# EAGLE design clogic (EAGLE 6.2)

## Sheet 1 of 2
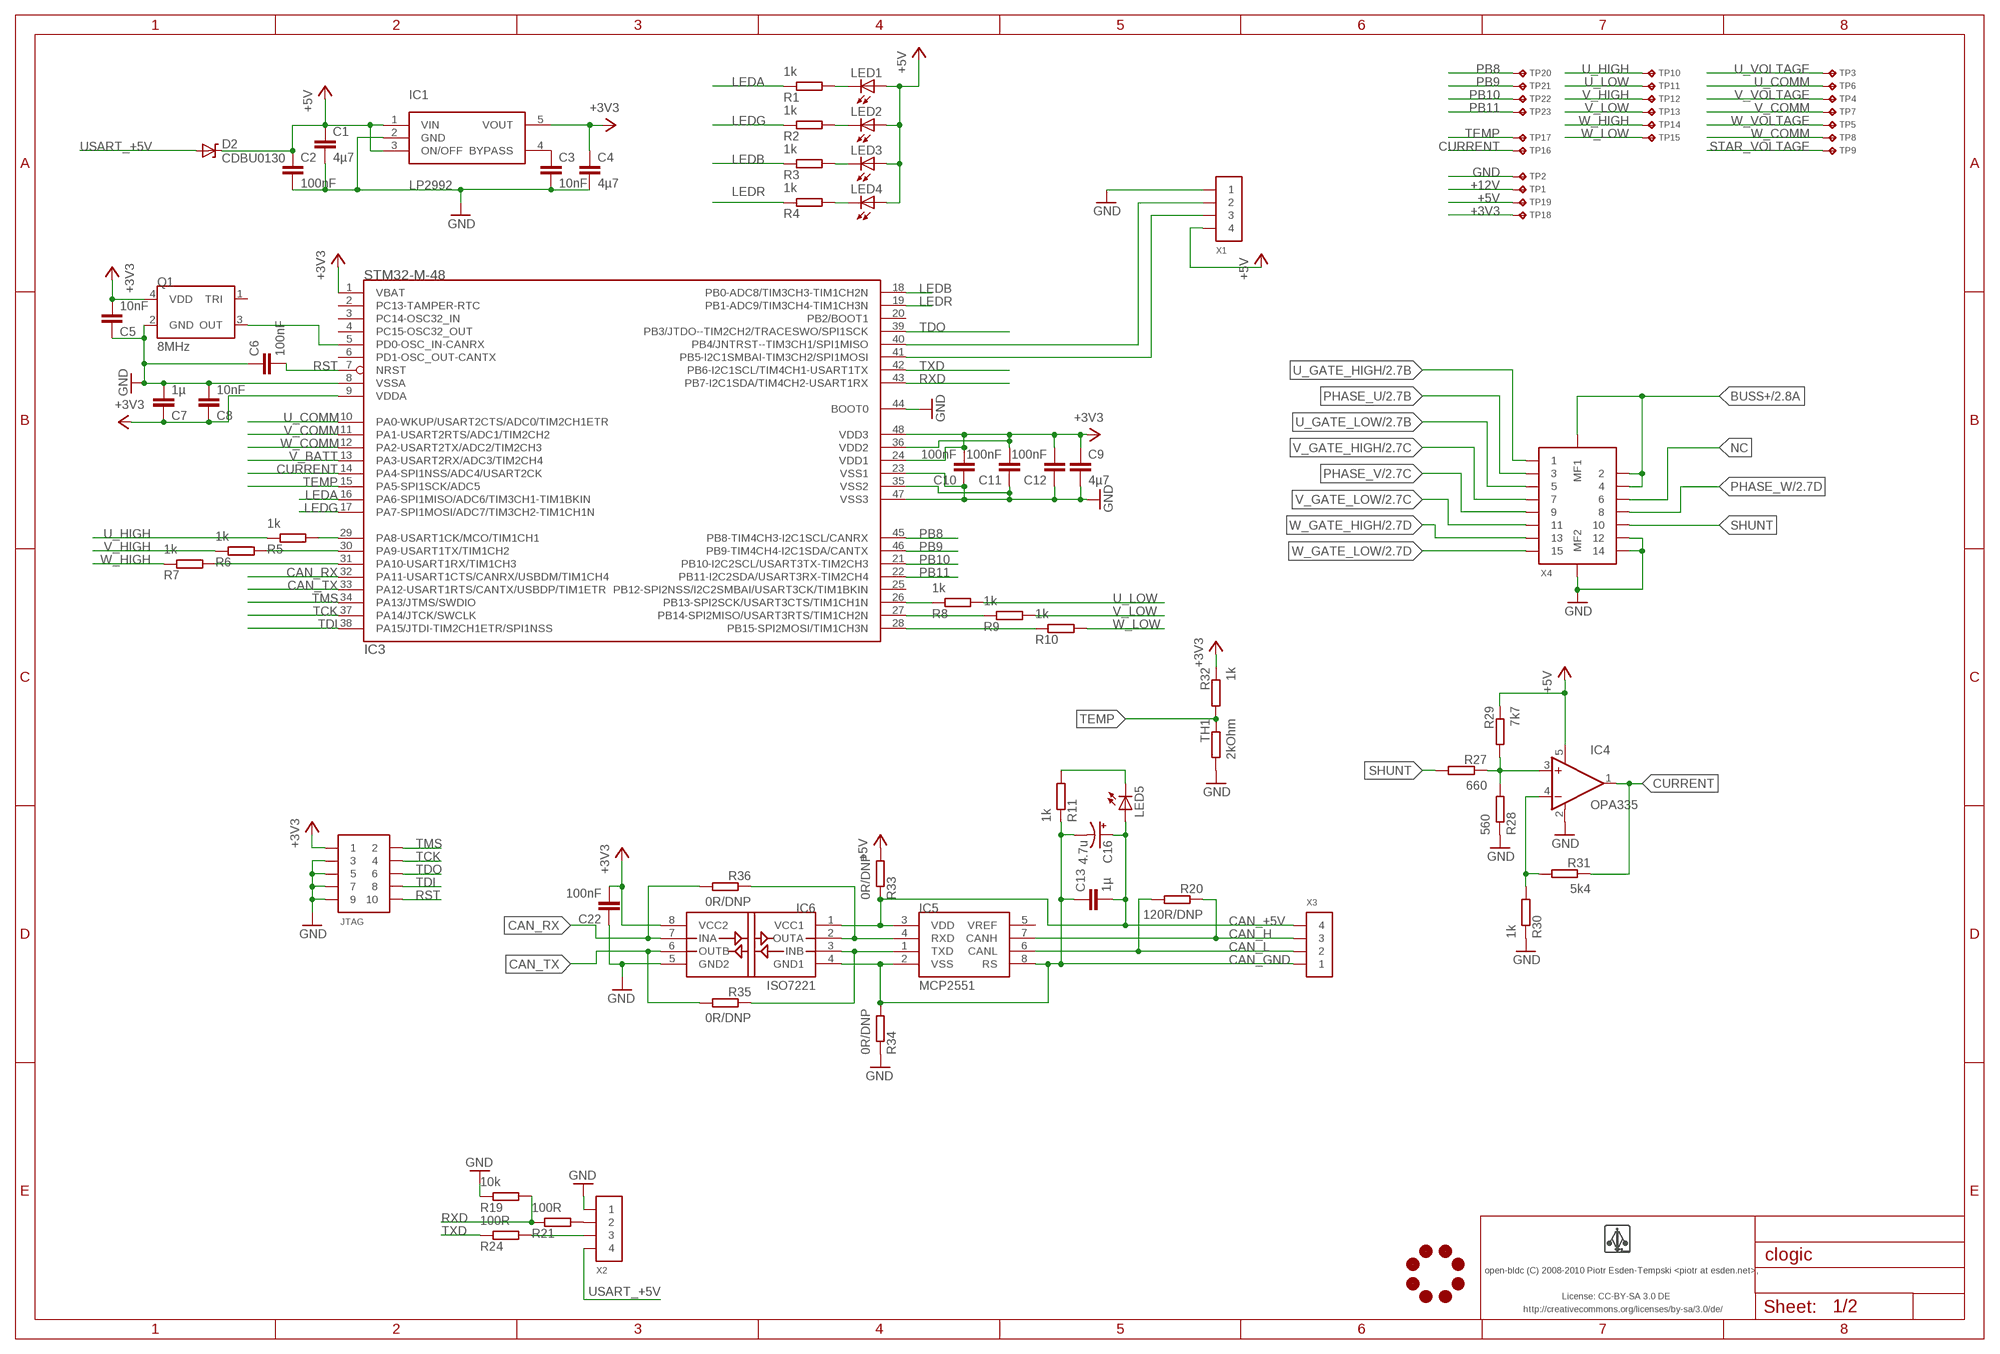
[diagram p0: schematic, sheet 1]

### Parts
C1  4µ7  CAPACITOR-0603  [0603-CAP]
C2  100nF  CAPACITOR-0603  [0603-CAP]
C3  10nF  CAPACITOR-0603  [0603-CAP]
C4  4µ7  CAPACITOR-0603  [0603-CAP]
C5  10nF  CAPACITOR-0603  [0603-CAP]
C6  100nF  CAPACITOR-0603  [0603-CAP]
C7  1µ  CAPACITOR-0603  [0603-CAP]
C8  10nF  CAPACITOR-0603  [0603-CAP]
C9  4µ7  CAPACITOR-0603  [0603-CAP]
C10  100nF  CAPACITOR-0603  [0603-CAP]
C11  100nF  CAPACITOR-0603  [0603-CAP]
C12  100nF  CAPACITOR-0603  [0603-CAP]
C13  1µ  CAPACITOR-0603  [0603-CAP]
C16  4.7u  CPOL-US  [CAP_0805TANT_F95]
C22  100nF  CAPACITOR-0603  [0603-CAP]
D2  CDBU0130  DIODE-ZENER-0603  [0603-LED]
IC1  LP2992  [SOT23-5]
IC3  STM32-M-48  [LQFP48]
IC4  OPA335  [SOT23-5]
IC5  MCP2551  [SO8]
IC6  ISO7221  [SO8]
JL1  JOBY_LOGO-6MIL  [JOBY_LOGO_6MIL]
JTAG  CONN_5-2-FTSH-V  [FTSH-105-DV]
LED1  AMBER  LED-0603  [0603-LED]
LED2  GREEN  LED-0603  [0603-LED]
LED3  BLUE  LED-0603  [0603-LED]
LED4  RED  LED-0603  [0603-LED]
LED5  WHITE  LED-0603  [0603-LED]
Q1  8MHz  ASE_ASCILLATOR  [ASE_OSCILLATOR]
R1  1k  RESISTOR-0603  [0603-RES]
R2  1k  RESISTOR-0603  [0603-RES]
R3  1k  RESISTOR-0603  [0603-RES]
R4  1k  RESISTOR-0603  [0603-RES]
R5  1k  RESISTOR-0603  [0603-RES]
R6  1k  RESISTOR-0603  [0603-RES]
R7  1k  RESISTOR-0603  [0603-RES]
R8  1k  RESISTOR-0603  [0603-RES]
R9  1k  RESISTOR-0603  [0603-RES]
R10  1k  RESISTOR-0603  [0603-RES]
R11  1k  RESISTOR-0603  [0603-RES]
R19  10k  RESISTOR-0603  [0603-RES]
R20  120R/DNP  RESISTOR-0603  [0603-RES]
R21  100R  RESISTOR-0603  [0603-RES]
R24  100R  RESISTOR-0603  [0603-RES]
R27  660  RESISTOR-0603  [0603-RES]
R28  560  RESISTOR-0603  [0603-RES]
R29  7k7  RESISTOR-0603  [0603-RES]
R30  1k  RESISTOR-0603  [0603-RES]
R31  5k4  RESISTOR-0603  [0603-RES]
R32  1k  RESISTOR-0603  [0603-RES]
R33  0R/DNP  RESISTOR-0603  [0603-RES]
R34  0R/DNP  RESISTOR-0603  [0603-RES]
R35  0R/DNP  RESISTOR-0603  [0603-RES]
R36  0R/DNP  RESISTOR-0603  [0603-RES]
TH1  2kOhm  RESISTOR-0603  [0603-RES]
TP1  TP-09RSMD  [TP09R]
TP2  TP-09RSMD  [TP09R]
TP3  TP-09RSMD  [TP09R]
TP4  TP-09RSMD  [TP09R]
TP5  TP-09RSMD  [TP09R]
TP6  TP-09RSMD  [TP09R]
TP7  TP-09RSMD  [TP09R]
TP8  TP-09RSMD  [TP09R]
TP9  TP-09RSMD  [TP09R]
TP10  TP-09RSMD  [TP09R]
TP11  TP-09RSMD  [TP09R]
TP12  TP-09RSMD  [TP09R]
TP13  TP-09RSMD  [TP09R]
TP14  TP-09RSMD  [TP09R]
TP15  TP-09RSMD  [TP09R]
TP16  TP-09RSMD  [TP09R]
TP17  TP-09RSMD  [TP09R]
TP18  TP-09RSMD  [TP09R]
TP19  TP-09RSMD  [TP09R]
TP20  TP-09RSMD  [TP09R]
TP21  TP-09RSMD  [TP09R]
TP22  TP-09RSMD  [TP09R]
TP23  TP-09RSMD  [TP09R]
U$1  LOGO  LOGO-NORM  [LOGO]
X1  CONN_4-1-53261  [PB-53261-04]
X2  CONN_4-1-53261  [PB-53261-04]
X3  CONN_4-1-53261  [PB-53261-04]
X4  CONN_15-2-2MT-DF9  [DF9-15]

### Nets
+3V3: C4.P$1 C5.P$2 C7.P$1 C8.P$1 C9.P$1 C10.P$2 C11.P$2 C12.P$2 C22.P$2 IC1.5(VOUT) IC3.1(VBAT) IC3.9(VDDA) IC3.24(VDD1) IC3.36(VDD2) IC3.48(VDD3) IC6.8(VCC2) JTAG.1 Q1.4(VDD) R32.P$1 TP18.P$1
+5V: C1.P$1 C2.P$1 D2.C IC1.1(VIN) IC1.3(ON/OFF) IC4.5(V+) LED1.A LED2.A LED3.A LED4.A R29.P$1 R33.P$2 TP19.P$1 X1.4 ; also sheet 2
+12V: TP1.P$1 ; also sheet 2
A: IC3.40(PB4/JNTRST--TIM3CH1/SPI1MISO) X1.2
B: IC3.41(PB5-I2C1SMBAI-TIM3CH2/SPI1MOSI) X1.3
BUSS+: X4.2 X4.4 X4.MF1 ; also sheet 2
CAN_+5V: C13.P$2 C16.P$1(+) IC5.3(VDD) IC6.1(VCC1) LED5.A R33.P$1 X3.4
CAN_GND: C13.P$1 C16.P$2(-) IC5.2(VSS) IC5.8(RS) IC6.4(GND1) R11.P$1 R34.P$2 X3.1
CAN_H: IC5.7(CANH) R20.P$1 X3.3
CAN_L: IC5.6(CANL) R20.P$2 X3.2
CAN_RX: IC3.32(PA11-USART1CTS/CANRX/USBDM/TIM1CH4) IC6.7(INA) R36.P$2
CAN_TX: IC3.33(PA12-USART1RTS/CANTX/USBDP/TIM1ETR) IC6.6(OUTB) R35.P$2
CURRENT: IC3.14(PA4-SPI1NSS/ADC4/USART2CK) IC4.1(OUT) R31.P$1 TP16.P$1
GND: C1.P$2 C2.P$2 C3.P$2 C4.P$2 C5.P$1 C6.P$1 C7.P$2 C8.P$2 C9.P$2 C10.P$1 C11.P$1 C12.P$1 C22.P$1 IC1.2(GND) IC3.8(VSSA) IC3.23(VSS1) IC3.35(VSS2) IC3.44(BOOT0) IC3.47(VSS3) IC4.2(V-) IC6.5(GND2) JTAG.3 JTAG.5 JTAG.7 JTAG.9 Q1.2(GND) R19.P$1 R28.P$1 R30.P$1 R34.P$1 TH1.P$2 TP2.P$1 X1.1 X2.1 X4.12 X4.14 X4.MF2 ; also sheet 2
LEDA: IC3.16(PA6-SPI1MISO/ADC6/TIM3CH1-TIM1BKIN) R1.P$1
LEDB: IC3.18(PB0-ADC8/TIM3CH3-TIM1CH2N) R3.P$1
LEDG: IC3.17(PA7-SPI1MOSI/ADC7/TIM3CH2-TIM1CH1N) R2.P$1
LEDR: IC3.19(PB1-ADC9/TIM3CH4-TIM1CH3N) R4.P$1
N$1: LED5.C R11.P$2
N$3: LED1.C R1.P$2
N$4: LED4.C R4.P$2
N$5: LED3.C R3.P$2
N$6: R21.P$2 X2.2
N$10: LED2.C R2.P$2
N$11: IC4.3(+IN) R27.P$1 R28.P$2 R29.P$2
N$12: IC4.4(-IN) R30.P$2 R31.P$2
N$13: IC5.1(TXD) IC6.3(INB) R35.P$1
N$14: IC5.4(RXD) IC6.2(OUTA) R36.P$1
N$20: R24.P$2 X2.3
N$22: C3.P$1 IC1.4(BYPASS)
N$33: IC3.26(PB13-SPI2SCK/USART3CTS/TIM1CH1N) R8.P$1
N$36: IC3.27(PB14-SPI2MISO/USART3RTS/TIM1CH2N) R9.P$1
N$39: IC3.28(PB15-SPI2MOSI/TIM1CH3N) R10.P$1
N$40: IC3.5(PD0-OSC_IN-CANRX) Q1.3(OUT)
N$41: IC3.29(PA8-USART1CK/MCO/TIM1CH1) R5.P$2
N$42: IC3.30(PA9-USART1TX/TIM1CH2) R6.P$2
N$45: IC3.31(PA10-USART1RX/TIM1CH3) R7.P$2
NC: X4.6
PB8: IC3.45(PB8-TIM4CH3-I2C1SCL/CANRX) TP20.P$1
PB9: IC3.46(PB9-TIM4CH4-I2C1SDA/CANTX) TP21.P$1
PB10: IC3.21(PB10-I2C2SCL/USART3TX-TIM2CH3) TP22.P$1
PB11: IC3.22(PB11-I2C2SDA/USART3RX-TIM2CH4) TP23.P$1
PHASE_U: X4.3 ; also sheet 2
PHASE_V: X4.9 ; also sheet 2
PHASE_W: X4.8 ; also sheet 2
RST: C6.P$2 IC3.7(NRST) JTAG.10
RXD: IC3.43(PB7-I2C1SDA/TIM4CH2-USART1RX) R19.P$2 R21.P$1
SHUNT: R27.P$2 X4.10
STAR_VOLTAGE: TP9.P$1 ; also sheet 2
TCK: IC3.37(PA14/JTCK/SWCLK) JTAG.4
TDI: IC3.38(PA15/JTDI-TIM2CH1ETR/SPI1NSS) JTAG.8
TDO: IC3.39(PB3/JTDO--TIM2CH2/TRACESWO/SPI1SCK) JTAG.6
TEMP: IC3.15(PA5-SPI1SCK/ADC5) R32.P$2 TH1.P$1 TP17.P$1
TMS: IC3.34(PA13/JTMS/SWDIO) JTAG.2
TXD: IC3.42(PB6-I2C1SCL/TIM4CH1-USART1TX) R24.P$1
U_COMM: IC3.10(PA0-WKUP/USART2CTS/ADC0/TIM2CH1ETR) TP6.P$1 ; also sheet 2
U_GATE_HIGH: X4.1 ; also sheet 2
U_GATE_LOW: X4.5 ; also sheet 2
U_HIGH: R5.P$1 TP10.P$1 ; also sheet 2
U_LOW: R8.P$2 TP11.P$1 ; also sheet 2
U_VOLTAGE: TP3.P$1 ; also sheet 2
USART_+5V: D2.A X2.4
V_BATT: IC3.13(PA3-USART2RX/ADC3/TIM2CH4) ; also sheet 2
V_COMM: IC3.11(PA1-USART2RTS/ADC1/TIM2CH2) TP7.P$1 ; also sheet 2
V_GATE_HIGH: X4.7 ; also sheet 2
V_GATE_LOW: X4.11 ; also sheet 2
V_HIGH: R6.P$1 TP12.P$1 ; also sheet 2
V_LOW: R9.P$2 TP13.P$1 ; also sheet 2
V_VOLTAGE: TP4.P$1 ; also sheet 2
W_COMM: IC3.12(PA2-USART2TX/ADC2/TIM2CH3) TP8.P$1 ; also sheet 2
W_GATE_HIGH: X4.13 ; also sheet 2
W_GATE_LOW: X4.15 ; also sheet 2
W_HIGH: R7.P$1 TP14.P$1 ; also sheet 2
W_LOW: R10.P$2 TP15.P$1 ; also sheet 2
W_VOLTAGE: TP5.P$1 ; also sheet 2
Unconnected: IC3.2(PC13-TAMPER-RTC) IC3.3(PC14-OSC32_IN) IC3.4(PC15-OSC32_OUT) IC3.6(PD1-OSC_OUT-CANTX) IC3.20(PB2/BOOT1) IC3.25(PB12-SPI2NSS/I2C2SMBAI/USART3CK/TIM1BKIN) IC5.5(VREF) Q1.1(TRI)

### Notes on the sheet
- open-bldc (C) 2008-2010 Piotr Esden-Tempski <piotr at esden.net>,
- License: CC-BY-SA 3.0 DE
- http://creativecommons.org/licenses/by-sa/3.0/de/

## Sheet 2 of 2
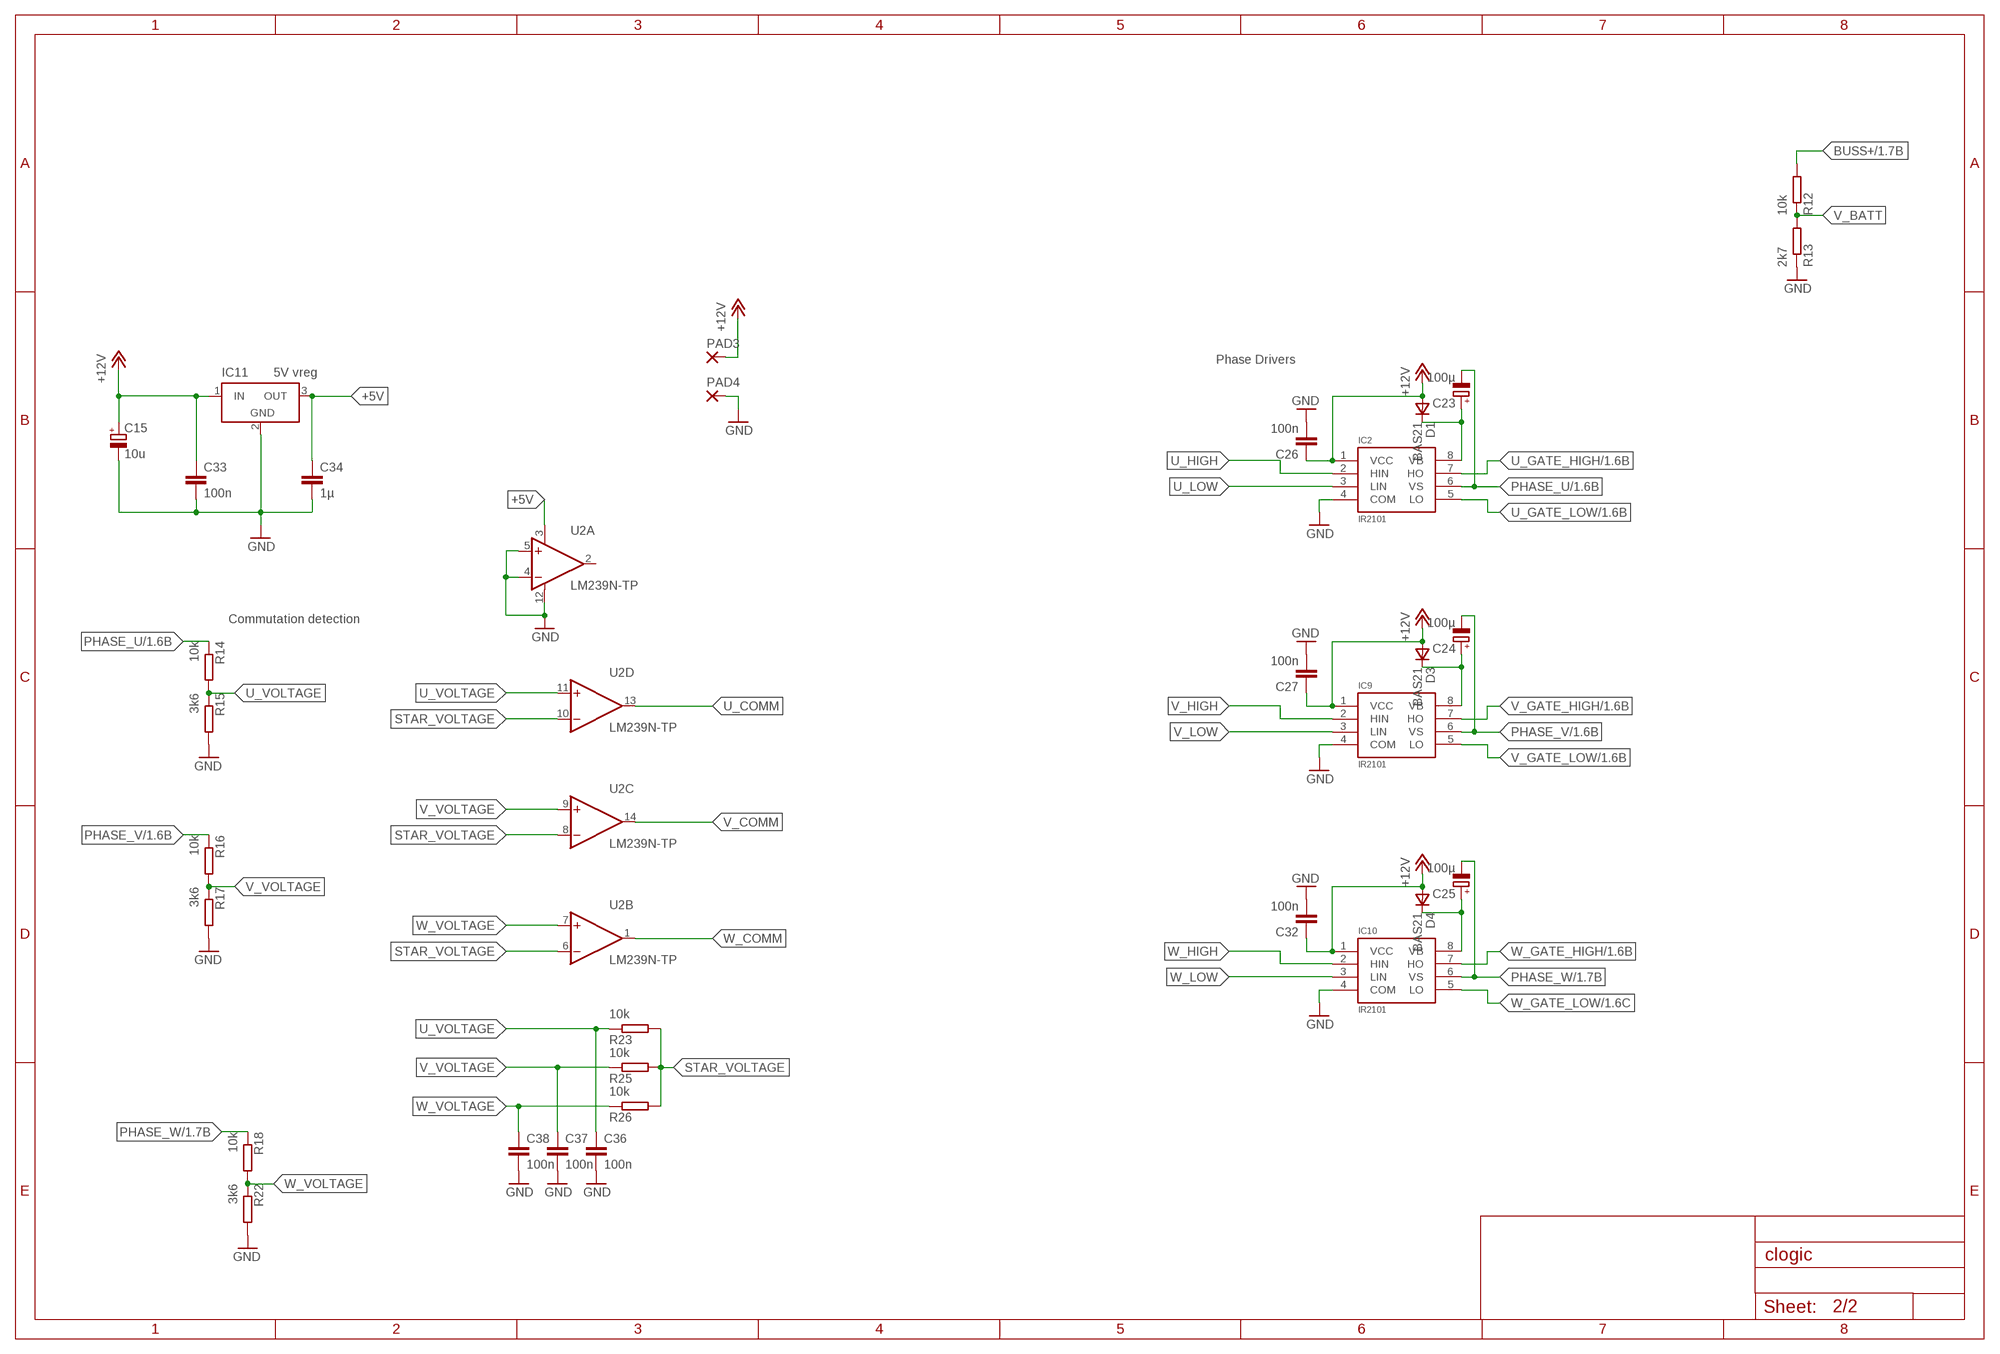
[diagram p1: schematic, sheet 2]

### Parts
C15  10u  CAPACITOR-POLB  [3528/B]
C23  100µ  CAPACITOR-POL-0805  [0805-POL-CAP]
C24  100µ  CAPACITOR-POL-0805  [0805-POL-CAP]
C25  100µ  CAPACITOR-POL-0805  [0805-POL-CAP]
C26  100n  CAPACITOR-0603  [0603-CAP]
C27  100n  CAPACITOR-0603  [0603-CAP]
C32  100n  CAPACITOR-0603  [0603-CAP]
C33  100n  CAPACITOR-0603  [0603-CAP]
C34  1µ  CAPACITOR-0603  [0603-CAP]
C36  100n  CAPACITOR-0603  [0603-CAP]
C37  100n  CAPACITOR-0603  [0603-CAP]
C38  100n  CAPACITOR-0603  [0603-CAP]
D1  BAS21  VAR2SOT23  [SOT-23]
D3  BAS21  VAR2SOT23  [SOT-23]
D4  BAS21  VAR2SOT23  [SOT-23]
IC2  IR2101  [SO-8]
IC9  IR2101  [SO-8]
IC10  IR2101  [SO-8]
IC11  5V vreg  LT1129CST5  [SOT223]
PAD3  SMD5  [SMD2,54-5,08]
PAD4  SMD5  [SMD2,54-5,08]
R12  10k  RESISTOR-0603  [0603-RES]
R13  2k7  RESISTOR-0603  [0603-RES]
R14  10k  RESISTOR-0603  [0603-RES]
R15  3k6  RESISTOR-0603  [0603-RES]
R16  10k  RESISTOR-0603  [0603-RES]
R17  3k6  RESISTOR-0603  [0603-RES]
R18  10k  RESISTOR-0603  [0603-RES]
R22  3k6  RESISTOR-0603  [0603-RES]
R23  10k  RESISTOR-0603  [0603-RES]
R25  10k  RESISTOR-0603  [0603-RES]
R26  10k  RESISTOR-0603  [0603-RES]
U2  LM239N-TP  [TSSOP_14]

### Nets
+5V: C34.P$1 IC11.3(OUT) U2.3(A:V+) ; also sheet 1
+12V: C15.+ C26.P$1 C27.P$1 C32.P$1 C33.P$1 D1.3(A) D3.3(A) D4.3(A) IC2.1(VCC) IC9.1(VCC) IC10.1(VCC) IC11.1(IN) PAD3.1(P) ; also sheet 1
BUSS+: R12.P$2 ; also sheet 1
GND: C15.- C26.P$2 C27.P$2 C32.P$2 C33.P$2 C34.P$2 C36.P$2 C37.P$2 C38.P$2 IC2.4(COM) IC9.4(COM) IC10.4(COM) IC11.2(GND) PAD4.1(P) R13.P$1 R15.P$2 R17.P$2 R22.P$2 U2.4(A:-IN) U2.5(A:+IN) U2.12(A:V-) ; also sheet 1
N$2: C23.+ D1.1(C) IC2.8(VB)
N$7: C24.+ D3.1(C) IC9.8(VB)
N$8: C25.+ D4.1(C) IC10.8(VB)
PHASE_U: C23.- IC2.6(VS) R14.P$1 ; also sheet 1
PHASE_V: C24.- IC9.6(VS) R16.P$1 ; also sheet 1
PHASE_W: C25.- IC10.6(VS) R18.P$1 ; also sheet 1
STAR_VOLTAGE: R23.P$2 R25.P$2 R26.P$2 U2.6(B:-IN) U2.8(C:-IN) U2.10(D:-IN) ; also sheet 1
U_COMM: U2.13(D:OUT) ; also sheet 1
U_GATE_HIGH: IC2.7(HO) ; also sheet 1
U_GATE_LOW: IC2.5(LO) ; also sheet 1
U_HIGH: IC2.2(HIN) ; also sheet 1
U_LOW: IC2.3(LIN) ; also sheet 1
U_VOLTAGE: C36.P$1 R14.P$2 R15.P$1 R23.P$1 U2.11(D:+IN) ; also sheet 1
V_BATT: R12.P$1 R13.P$2 ; also sheet 1
V_COMM: U2.14(C:OUT) ; also sheet 1
V_GATE_HIGH: IC9.7(HO) ; also sheet 1
V_GATE_LOW: IC9.5(LO) ; also sheet 1
V_HIGH: IC9.2(HIN) ; also sheet 1
V_LOW: IC9.3(LIN) ; also sheet 1
V_VOLTAGE: C37.P$1 R16.P$2 R17.P$1 R25.P$1 U2.9(C:+IN) ; also sheet 1
W_COMM: U2.1(B:OUT) ; also sheet 1
W_GATE_HIGH: IC10.7(HO) ; also sheet 1
W_GATE_LOW: IC10.5(LO) ; also sheet 1
W_HIGH: IC10.2(HIN) ; also sheet 1
W_LOW: IC10.3(LIN) ; also sheet 1
W_VOLTAGE: C38.P$1 R18.P$2 R22.P$1 R26.P$1 U2.7(B:+IN) ; also sheet 1
Unconnected: U2.2(A:OUT)

### Notes on the sheet
- Phase Drivers
- Commutation detection

## Power pins joined to a net without a drawn wire
GND: IC11.4(GND)

## Library data of the parts
C1-C13 C22 C26 C27 C32-C34 C36-C38 = pel_dipol_comp:CAPACITOR
C15 C23-C25 = pel_dipol_comp:CAPACITOR-POL
C16 = booz_imu_h:CPOL-US: POLARIZED CAPACITOR, American symbol
D1 D3 D4 = zetex:VAR2SOT23: DIODE
D2 = pel_dipol_comp:DIODE-ZENER
IC1 = open-bldc:LP2992
IC2 IC9 IC10 = open-bldc:IR2101
IC3 = pel_stm32:STM32-M-48: STM32F103 Medium Density 48pins
IC4 = open-bldc:OPA335
IC5 = open-bldc:MCP2551
IC6 = open-bldc:ISO7221
IC11 = linear-technology:LT1129CST5: VOLTAGE REGULATOR with shutdown
JL1 = open-bldc:JOBY_LOGO
JTAG = pel_misc:CONN_5-2
LED1-LED5 = pel_dipol_comp:LED
PAD3 PAD4 = wirepad:SMD5: SMD PAD
Q1 = open-bldc:ASE_ASCILLATOR
R1-R36 TH1 = pel_dipol_comp:RESISTOR
TP1-TP23 = pel_misc:TP
U2 = open-bldc:LM239N
U$1 = open-bldc:LOGO
X1-X3 = pel_molex:CONN_4-1
X4 = open-bldc:CONN_15-2-2MT

## Board
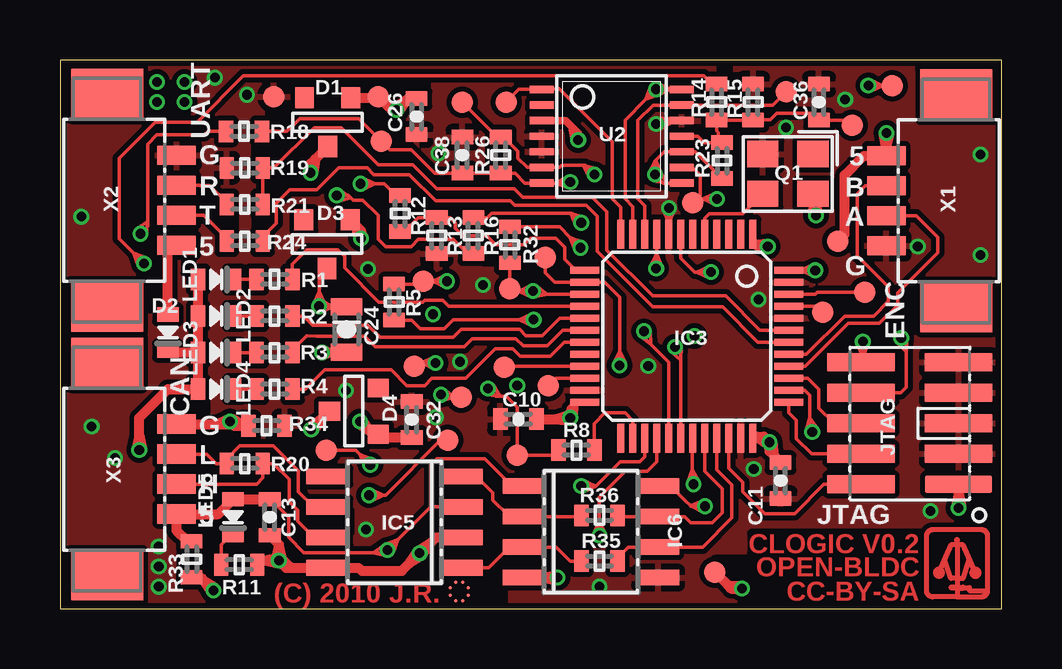
[diagram p2: board, top side]
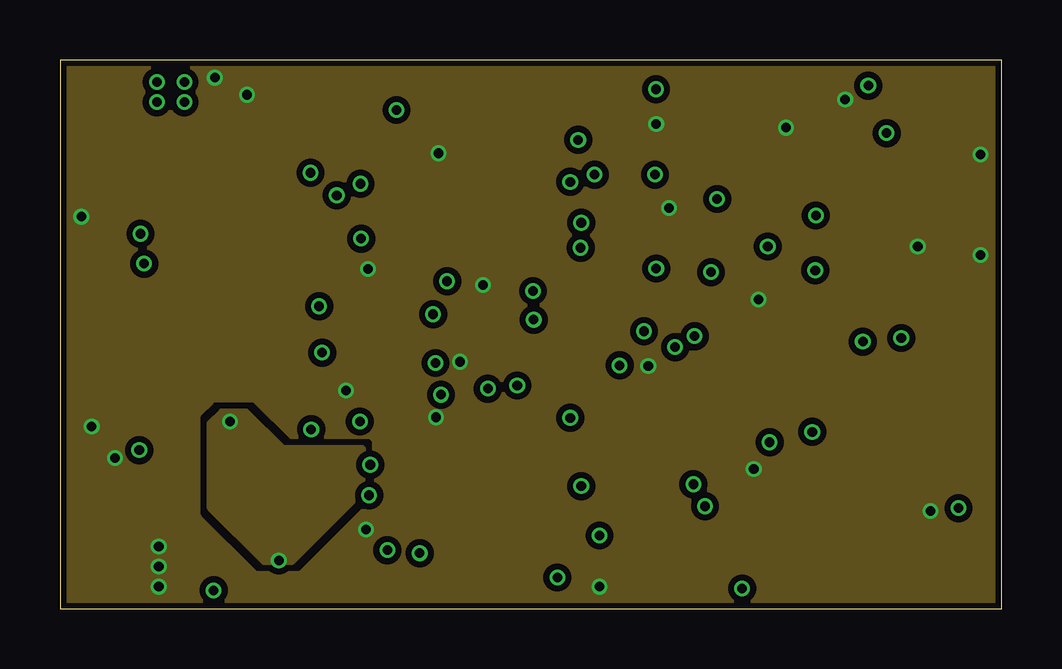
[diagram p3: board, inner layer Route2]
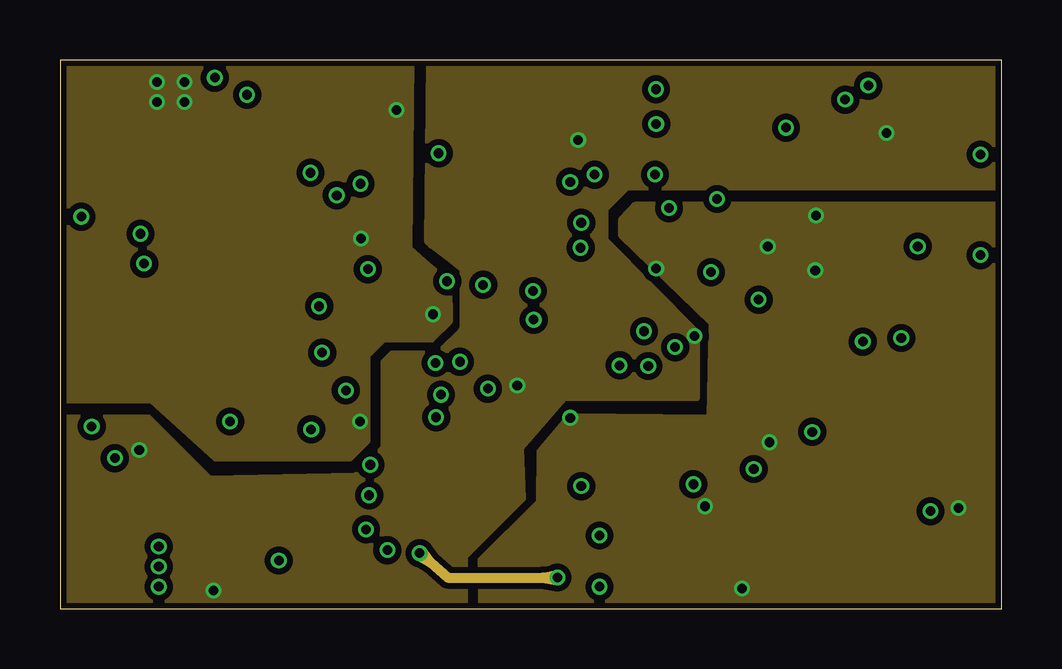
[diagram p4: board, inner layer Route15]
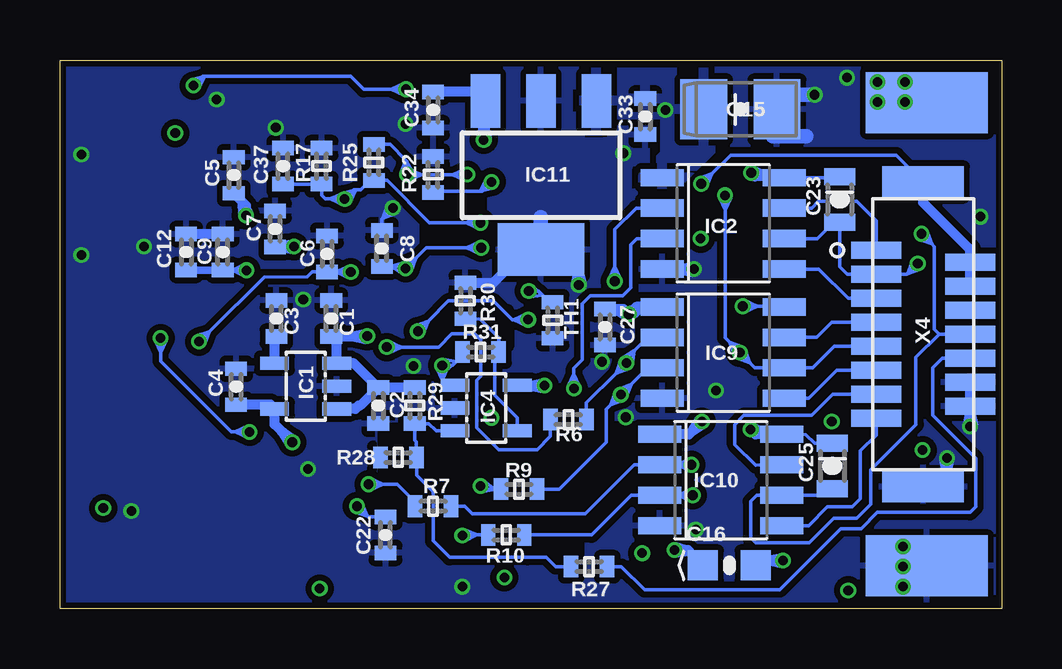
[diagram p5: board, bottom side, seen from below]

Size 39.24 x 22.86 mm. Coordinates in mm from the lower left corner, seen from the top.
Outline: 0,0 39.24,0 39.24,22.86 0,22.86 0,0
Copper layers (1*2+15*16): Top 0.035mm / dielectric 0.75mm / Route2 0.035mm / dielectric 0.15mm / Route15 0.035mm / dielectric 0.75mm / Bottom 0.035mm
Design rules: minimum track width 6mil, minimum drill 15mil, track to track 6mil, track to pad 6mil, pad to pad 6mil, via to via 6mil, smd to smd 6mil, copper to edge 10mil, drill to drill 8mil, minimum pad ring 5mil, minimum via ring 5mil, stop-mask expansion 4mil, vias tented up to drill 0.4mm, thermal gap 10mil
tRestrict: area 27.3,1.6 to 29.8,2; area 32,2.6 to 33.3,3.1; area 11.7,3.2 to 12.1,4.1; area 8.8,6.6 to 11,7.1; area 3.3,12.5 to 4.2,12.8; area 5.7,7.9 to 6.1,8.7; area 9.4,9.4 to 9.7,13.4; area 13.7,19.5 to 14.5,20; area 14.9,21.5 to 15.3,22.1; area 7.1,15.6 to 7.3,16.5; area 8.2,15.6 to 8.4,16.5; area 8.2,18.6 to 8.5,19.5; area 18,0.2 to 18.5,1; area 27.6,22 to 27.8,22.7; area 28.4,18.4 to 28.6,19.5; area 5.2,14 to 5.5,15; area 28.2,21.5 to 28.5,22.1; area 5.1,1.5 to 5.3,2.6; area 17.6,14.5 to 18.4,14.7; area 17.9,18.4 to 18.2,19.4; area 8.7,20.3 to 9,21.1
bRestrict: area 24.3,4.7 to 25.8,7.5; area 20.6,10.9 to 22.5,12.4; area 17.7,2.1 to 19.8,3; area 26.5,8.6 to 27.2,9.6; area 21.7,15 to 24,17.2; area 13.7,2.1 to 15,3; area 15.1,6.9 to 16.3,7.6

### Footprints (pad centres in the part's own frame; a part is rotated, then mirrored left to right if it is on the bottom)
0603-CAP = smd 0.6 x 0.9: P$1 -0.75,0; P$2 0.75,0
3528/B = smd 1.95 x 2.5: + -1.525,0; - 1.525,0
CAP_0805TANT_F95 = smd 1.25 x 1.25: P$1 -1.1,0; P$2 1.1,0
0805-POL-CAP = smd 0.7 x 1.3: + -0.95,0; - 0.95,0
SOT-23 = smd 0.787 x 0.889: 1 0.025,-1.016; 2 -0.94,1.016; 3 0.991,1.016
0603-LED = smd 0.6 x 0.9: A 0.75,0; C -0.75,0
SOT23-5 = smd 0.55 x 1.2: 1 -0.95,-1.3; 2 0,-1.3; 3 0.95,-1.3; 4 0.95,1.3; 5 -0.95,1.3
SO-8 = smd 0.72 x 1.78: 1 -1.905,-2.543; 2 -0.635,-2.543; 3 0.635,-2.543; 4 1.905,-2.543; 5 1.905,2.543; 6 0.635,2.543; 7 -0.635,2.543; 8 -1.905,2.543
LQFP48 = smd 0.3 x 1.2: 1 -2.75,-4.25; 2 -2.25,-4.25; 3 -1.75,-4.25; 4 -1.25,-4.25; 5 -0.75,-4.25; 6 -0.25,-4.25; 7 0.25,-4.25; 8 0.75,-4.25; 9 1.25,-4.25; 10 1.75,-4.25; 11 2.25,-4.25; 12 2.75,-4.25; 25 2.75,4.25; 26 2.25,4.25; 27 1.75,4.25; 28 1.25,4.25; 29 0.75,4.25; 30 0.25,4.25; 31 -0.25,4.25; 32 -0.75,4.25; 33 -1.25,4.25; 34 -1.75,4.25; 35 -2.25,4.25; 36 -2.75,4.25 | smd 1.2 x 0.3: 13 4.25,-2.75; 14 4.25,-2.25; 15 4.25,-1.75; 16 4.25,-1.25; 17 4.25,-0.75; 18 4.25,-0.25; 19 4.25,0.25; 20 4.25,0.75; 21 4.25,1.25; 22 4.25,1.75; 23 4.25,2.25; 24 4.25,2.75; 37 -4.25,2.75; 38 -4.25,2.25; 39 -4.25,1.75; 40 -4.25,1.25; 41 -4.25,0.75; 42 -4.25,0.25; 43 -4.25,-0.25; 44 -4.25,-0.75; 45 -4.25,-1.25; 46 -4.25,-1.75; 47 -4.25,-2.25; 48 -4.25,-2.75
SO8 = smd 0.65 x 1.75: 1 -1.905,-2.8; 2 -0.635,-2.8; 3 0.635,-2.8; 4 1.905,-2.8; 5 1.905,2.8; 6 0.635,2.8; 7 -0.635,2.8; 8 -1.905,2.8
SOT223 = smd 1.219 x 2.235: 1 -2.311,-3.099; 2 0,-3.099; 3 2.311,-3.099 | smd 3.6 x 2.2: 4 0,3.099
JOBY_LOGO_6MIL = smd 0.152 x 0.152: 1 -0.152,0.381; 2 0.152,0.381; 3 0.381,0.152; 4 0.381,-0.152; 5 0.152,-0.381; 6 -0.152,-0.381; 7 -0.381,-0.152; 8 -0.381,0.152
FTSH-105-DV = smd 0.74 x 2.8: 1 -2.54,-2.03; 2 -2.54,2.03; 3 -1.27,-2.03; 4 -1.27,2.03; 5 0,-2.03; 6 0,2.03; 7 1.27,-2.03; 8 1.27,2.03; 9 2.54,-2.03; 10 2.54,2.03
SMD2,54-5,08 = smd 2.54 x 5.08: 1 0,0
ASE_OSCILLATOR = smd 1.3 x 1.1: 1 -1.05,-0.825; 2 1.05,-0.825; 3 1.05,0.825; 4 -1.05,0.825
0603-RES = smd 0.6 x 0.9: P$1 -0.75,0; P$2 0.75,0
TP09R = smd 0.9 x 0.9: P$1 0,0
TSSOP_14 = smd 0.305 x 0.991: 1 -1.95,-2.918; 2 -1.3,-2.918; 3 -0.65,-2.918; 4 0,-2.918; 5 0.65,-2.918; 6 1.3,-2.918; 7 1.95,-2.918; 8 1.95,2.918; 9 1.3,2.918; 10 0.65,2.918; 11 0,2.918; 12 -0.65,2.918; 13 -1.3,2.918; 14 -1.95,2.918
PB-53261-04 = smd 0.8 x 1.6: 1 -1.875,1.1; 2 -0.625,1.1; 3 0.625,1.1; 4 1.875,1.1 | smd 2.1 x 3: MNT1 -4.425,-1.8; MNT2 4.425,-1.8
DF9-15 = smd 0.7 x 2.08: 1 -3.5,-1.96; 2 -3,1.96; 3 -2.5,-1.96; 4 -2,1.96; 5 -1.5,-1.96; 6 -1,1.96; 7 -0.5,-1.96; 8 0,1.96; 9 0.5,-1.96; 10 1,1.96; 11 1.5,-1.96; 12 2,1.96; 13 2.5,-1.96; 14 3,1.96; 15 3.5,-1.96 | smd 1.3 x 3.4: MF1 -6.35,0; MF2 6.35,0

### Placement (x,y rotation side)
C1  27.94,12.09 90 bottom
C2  25.98,8.46 270 bottom
C3  30.23,12.09 90 bottom
C4  31.9,9.25 90 bottom
C5  32,18.06 270 bottom
C6  28.12,14.78 270 bottom
C7  30.28,15.82 90 bottom
C8  25.83,15.01 90 bottom
C9  32.46,14.86 90 bottom
C10  19.1,7.9 0 top
C11  30.02,5.33 90 top
C12  33.99,14.86 270 bottom
C13  8.74,3.81 90 top
C15  10.9,20.8 0 bottom
C16  11.35,1.8 0 bottom
C22  25.68,3.07 90 bottom
C23  6.76,17.04 270 bottom
C24  11.94,11.63 270 top
C25  7.06,5.94 270 bottom
C26  14.86,20.5 270 top
C27  16.54,11.73 270 bottom
C32  14.66,7.87 90 top
C33  14.86,20.5 270 bottom
C34  23.7,20.78 270 bottom
C36  31.62,21.11 90 top
C37  29.95,18.44 90 bottom
C38  16.76,18.9 90 top
D1  11.13,20.27 0 top
D2  4.5,11.51 90 top
D3  11.1,15.19 0 top
D4  12.24,8.26 270 top
DRILEGEND  [DRILEGEND]  -1.33,-7.14 0 top  (outside the outline)
IC1  29.01,9.27 90 bottom
IC2  11.61,16.05 270 bottom
IC3  26.11,11.35 180 top
IC4  21.49,8.36 270 bottom
IC5  13.94,3.61 90 top
IC6  22.12,3.2 270 top
IC9  11.61,10.67 270 bottom
IC10  11.71,5.36 270 bottom
IC11  19.2,18.06 180 bottom
JL1  16.64,0.71 0 top
JTAG  35.41,7.72 90 top
LED1  6.5,13.72 180 top
LED2  6.5,12.19 180 top
LED3  6.5,10.67 180 top
LED4  6.5,9.14 180 top
LED5  7.21,3.81 90 top
PAD3  3.12,21.08 90 bottom
PAD4  3.12,1.78 90 bottom
Q1  30.33,18.11 180 top
R1  8.94,13.72 180 top
R2  8.94,12.19 180 top
R3  8.94,10.67 180 top
R4  8.94,9.14 180 top
R5  13.92,12.78 270 top
R6  18.06,7.87 180 bottom
R7  23.7,4.27 180 bottom
R8  21.51,6.6 180 top
R9  20.12,4.98 0 bottom
R10  20.65,3.07 0 bottom
R11  7.47,1.83 180 top
R12  14.17,16.46 90 top
R13  15.7,15.54 90 top
R14  27.36,21.11 270 top
R15  28.88,21.11 90 top
R16  17.22,15.54 90 top
R17  28.35,18.44 90 bottom
R18  7.67,19.89 0 top
R19  7.7,18.36 0 top
R20  7.7,6.05 180 top
R21  7.7,16.84 180 top
R22  23.7,18.08 90 bottom
R23  27.58,18.67 270 top
R24  7.7,15.32 180 top
R25  26.16,18.59 90 bottom
R26  18.36,18.9 90 top
R27  17.2,1.75 0 bottom
R28  25.15,6.3 0 bottom
R29  24.46,8.46 270 bottom
R30  22.35,12.83 270 bottom
R31  21.72,10.69 0 bottom
R32  18.75,15.16 270 top
R33  5.49,2.06 270 top
R34  8.61,7.62 180 top
R35  22.48,1.98 0 top
R36  22.48,3.89 0 top
TH1  18.72,12.01 270 bottom
TP1  13.26,21.34 0 top
TP2  8.92,21.34 0 top
TP3  33.02,20.14 0 top
TP4  26.37,16.92 0 top
TP5  13.39,19.48 0 top
TP6  30.25,21.54 0 top
TP7  34.67,21.79 0 top
TP8  18.59,21.11 0 top
TP9  16.76,21.11 0 top
TP10  15.14,13.64 0 top
TP11  19.05,6.4 0 top
TP12  14.76,10.11 0 top
TP13  16.71,8.81 0 top
TP14  11.1,6.6 0 top
TP15  16.15,7.01 0 top
TP16  20.22,14.63 0 top
TP17  18.75,13.34 0 top
TP18  27.28,1.52 0 top
TP19  32.41,15.32 0 top
TP20  31.78,12.34 0 top
TP21  33.53,13.18 0 top
TP22  18.52,10.06 0 top
TP23  20.35,9.3 0 top
U2  22.99,19.68 270 top
U$1  37.36,1.78 0 top
X1  35.53,16.99 90 top
X2  3.76,17.02 270 top
X3  3.76,5.82 270 top
X4  3.28,11.43 270 bottom

### Tracks (layer width: path | path; a pad name or v marks a point on that pad's centre or on a via)
+3V3  (via drill 0.4, 0.4 pad 0.65)
  Top 0.152: 24.86,14.77 24.86,14.19 v24.84,14.17 | 24.86,14.77 IC3.9 | IC3.48 30.87,14.1 | 30.87,14.1 v31.47,14.1 | Q1.4 31.47,17.19 31.47,16.98 | IC6.8 25.45,5.11 25.81,4.75 26.06,4.5 26.27,4.28 | 26.27,4.28 26.29,4.27 v26.87,4.27 | 28.96,7.16 28.9,7.1 IC3.36 | R32.P$1 20.82,15.91 21.27,15.46 | 21.27,15.46 v21.69,15.04 | 31.47,16.98 31.47,16.81 | 24.86,14.77 24.62,14.29 v24.84,14.17 | 24.86,14.77 25.07,14.27 v24.84,14.17 | 30.87,14.1 31.37,13.87 v31.47,14.1 | 30.87,14.1 31.37,14.32 v31.47,14.1 | 21.27,15.46 21.46,14.95 v21.69,15.04 | 21.27,15.46 21.78,15.27 v21.69,15.04 | 26.27,4.28 26.76,4.04 v26.87,4.27 | 26.27,4.28 26.77,4.5 v26.87,4.27 | 31.47,16.98 31.26,16.48 v31.5,16.38 31.72,16.5 31.47,16.98
  Top 0.305: v21.26,7.95 21.26,8.33 21.45,8.52 | 21.45,8.52 21.53,8.6 IC3.24 | v29.49,15.09 29.03,15.09 28.9,15.21 | 28.9,15.21 28.88,15.23 IC3.1 | 21.45,8.52 21.12,8.05 v21.26,7.95 | 21.45,8.52 21.43,7.95 v21.26,7.95 | 28.9,15.21 29.41,14.93 v29.49,15.09 | 28.9,15.21 29.47,15.26 v29.49,15.09
  Top 0.406: 37.44,4.79 v37.44,4.19 | 37.44,4.79 JTAG.1 | C10.P$2 20.66,7.9 | 20.66,7.9 21.21,7.9 v21.26,7.95 | v29.57,6.93 29.57,6.55 29.75,6.36 | 29.75,6.36 C11.P$2 | 28.96,7.16 29.01,7.16 | 29.01,7.16 29.34,7.16 v29.57,6.93 | TP18.P$1 27.84,0.97 | 27.84,0.97 27.96,0.84 v28.42,0.84 | Q1.4 31.38,16.97 | 31.38,16.97 31.38,16.5 v31.5,16.38 | 20.66,7.9 21.24,7.83 v21.26,7.95 | 20.66,7.9 21.22,8.07 v21.26,7.95 | 29.75,6.36 29.69,6.95 v29.57,6.93 | 29.75,6.36 29.46,6.87 v29.57,6.93 | 29.01,7.16 29.5,6.83 v29.57,6.93 | 29.01,7.16 29.59,7.06 v29.57,6.93 | 37.44,4.79 37.32,4.22 v37.44,4.19 | 37.44,4.79 37.56,4.22 v37.44,4.19 | 27.84,0.97 28.37,0.72 v28.42,0.84 | 27.84,0.97 28.42,0.96 v28.42,0.84 | 31.38,16.97 31.37,16.38 v31.5,16.38 | 31.38,16.97 31.61,16.43 v31.5,16.38
  Bottom 0.152: 25.43,14.26 24.93,14.26 v24.84,14.17 | 25.43,14.26 C8.P$1 | v21.69,15.04 22.29,15.04 | 22.29,15.04 23.98,15.04 24.42,14.6 | 24.42,14.6 v24.84,14.17 | C9.P$1 32.45,14.1 32.07,14.1 | v31.47,14.1 32.07,14.1 | C22.P$2 26.43,3.83 26.44,3.85 | v26.87,4.27 26.44,3.85 | 25.43,14.26 24.91,14.41 v24.84,14.17 | 25.43,14.26 24.98,13.96 v24.84,14.17 | 24.42,14.6 24.61,14.09 v24.84,14.17 | 24.42,14.6 24.93,14.41 v24.84,14.17 | 32.07,14.1 31.58,14.32 v31.47,14.1 | 32.07,14.1 31.58,13.87 v31.47,14.1 | 22.29,15.04 21.8,15.27 v21.69,15.04 | 22.29,15.04 21.8,14.81 v21.69,15.04 | 26.44,3.85 26.96,4.03 v26.87,4.27 | 26.44,3.85 26.64,4.36 v26.87,4.27
  Bottom 0.305: C9.P$1 C12.P$2
  Bottom 0.406: v29.57,6.93 29.99,7.36 | 29.99,7.36 30.3,7.68 IC1.5 30.48,8.5 C4.P$1 | C7.P$1 30.09,15.07 | 30.09,15.07 29.5,15.07 v29.49,15.09 | v31.5,16.38 31.5,16.8 31.66,16.96 | 31.66,16.96 C5.P$2 | 29.99,7.36 29.5,7.04 v29.57,6.93 | 29.99,7.36 29.67,6.87 v29.57,6.93 | 30.09,15.07 29.52,15.21 v29.49,15.09 | 30.09,15.07 29.51,14.97 v29.49,15.09 | 31.66,16.96 31.39,16.44 v31.5,16.38 | 31.66,16.96 31.62,16.38 v31.5,16.38
  pour Route15 (isolate 0.254, rank 6): 17.53,0 17.5,2.03 19.94,4.45 19.96,6.55 21.23,8.05 27.05,8 27.13,11.86 23.37,15.52 23.37,16.23 23.75,16.61 23.98,16.87 39.24,16.89 39.24,0
+5V  (via drill 0.4 pad 0.65)
  Top 0.305: U2.3 21.07,20.34 21.33,20.07 | 21.33,20.07 21.59,19.81 v21.59,19.53 | 21.33,20.07 21.42,19.51 v21.59,19.53 | 21.33,20.07 21.72,19.65 v21.59,19.53
  Top 0.406: LED3.A LED4.A 4.5,9.14 3.3,7.95 3.3,7.2 | LED3.A LED2.A LED1.A | v3.3,6.6 3.3,7.2 | 34.44,19.21 X1.4 33.5,18.87 32.69,18.06 32.69,15.6 TP19.P$1 | 34.44,19.21 v34.44,19.8 v34.44,19.81 | LED3.A | R33.P$2 5.86,1.31 5.98,1.19 | 5.98,1.19 v6.4,0.76 | D2.C 4.58,10.67 LED3.A | 34.44,19.21 34.56,19.79 v34.44,19.81 | 34.44,19.21 34.32,19.79 v34.44,19.81 | 3.3,7.2 3.18,6.63 v3.3,6.6 | 3.3,7.2 3.42,6.63 v3.3,6.6 | 5.98,1.19 6.3,0.69 v6.4,0.76 | 5.98,1.19 6.47,0.87 v6.4,0.76
  Bottom 0.152: IC1.3
  Bottom 0.406: v21.59,19.53 21.59,20.13 | 21.59,20.13 21.59,21.08 IC11.3 21.88,21.53 C34.P$1 | 27.04,11.34 C1.P$1 27.71,11.11 IC1.3 27,10.22 C2.P$1 | 27.04,11.34 26.45,11.34 v26.44,11.35 | R29.P$1 C2.P$1 | IC4.5 20.18,9.3 19.65,9.3 | 19.65,9.3 v19.05,9.3 | IC1.1 26.93,8.32 26.8,8.46 26.73,8.46 C2.P$1 | 21.59,20.13 21.47,19.56 v21.59,19.53 | 21.59,20.13 21.71,19.56 v21.59,19.53 | 27.04,11.34 26.47,11.47 v26.44,11.35 | 27.04,11.34 26.46,11.23 v26.44,11.35 | 19.65,9.3 19.08,9.42 v19.05,9.3 | 19.65,9.3 19.08,9.18 v19.05,9.3
  pour Route15 (isolate 0.254, rank 6): 16.89,0 0,0 0,8 3.68,8 6.22,5.46 12.32,5.59 13.46,6.73 13.46,10.29 13.84,10.67 15.75,10.67 16.76,11.68 16.76,14.1 16.13,14.61 15.44,15.11 15.29,15.27 15.37,22.86 38.99,22.86 38.99,17.53 23.62,17.53 22.73,16.64 22.73,15.37 26.54,11.51 26.54,8.74 21.01,8.74 19.23,6.68 19.3,4.57 16.89,2.16
+12V  (via drill 0.4, 0.4 pad 0.65)
  Top 0.406: D3.3 12.32,15.97 | 12.32,15.97 12.55,15.75 v12.55,15.42 | D1.3 13.21,21.29 TP1.P$1 13.51,21.09 | v14.02,20.78 13.82,20.78 13.51,21.09 | v14.02,20.78 14.45,21.2 | 14.45,21.2 14.48,21.23 14.77,21.25 C33.P$1 | C32.P$1 13.37,7.11 D4.3 13.03,7.26 12.92,7.37 | 12.92,7.37 v12.5,7.8 | 12.92,7.37 12.6,7.87 v12.5,7.8 | 12.92,7.37 12.43,7.69 v12.5,7.8 | 12.32,15.97 12.43,15.4 v12.55,15.42 | 12.32,15.97 12.65,15.49 v12.55,15.42 | 13.51,21.09 13.94,20.69 v14.02,20.78 | 13.51,21.09 14.06,20.89 v14.02,20.78 | 14.45,21.2 13.95,20.88 v14.02,20.78 | 14.45,21.2 14.12,20.71 v14.02,20.78
  Bottom 0.152: PAD3.1 3.15,21.11 3.44,21.11 | 3.44,21.11 v4.04,21.11 | 3.44,21.11 3.93,20.88 v4.04,21.11 | 3.44,21.11 3.93,21.34 v4.04,21.11
  Bottom 0.406: v12.5,7.8 12.92,7.37 | 12.92,7.37 13.03,7.26 IC10.1 | IC9.1 15.03,12.57 | 15.03,12.57 15.24,12.57 v15.54,12.27 | 16.1,12.48 15.76,12.48 v15.54,12.27 | 16.1,12.48 C27.P$1 | 12.92,7.37 12.6,7.87 v12.5,7.8 | 12.92,7.37 12.43,7.69 v12.5,7.8 | 15.03,12.57 15.46,12.18 v15.54,12.27 | 15.03,12.57 15.58,12.39 v15.54,12.27 | 16.1,12.48 15.53,12.39 v15.54,12.27 | 16.1,12.48 15.61,12.16 v15.54,12.27
  other vias: 4.04,21.95 5.18,21.95 5.18,21.11
  pour Route15 (isolate 0.254): 0,22.86 14.66,22.86 14.58,15.04 15.37,14.33 15.85,13.94 16.23,13.56 16.26,11.94 15.49,11.18 13.46,11.18 12.83,10.54 12.83,6.99 12.06,6.22 6.48,6.22 3.81,8.64 0,8.64
  pour Bottom: 11.63,22.35 11.63,19.58 13.54,17.68 14.94,17.68 14.94,18.06 14.02,18.97 14.02,20.57 15.85,20.57 16.33,20.09 17.4,20.07 17.4,22.35
A
  Top 0.152: X1.2 35.68,16.37 36.58,15.47 36.58,14.83 34.9,13.16 34.9,12.65 34.14,11.89 32.84,11.89 31.06,10.1 IC3.40
B
  Top 0.152: 34.42,17.6 X1.3 33.54,17.62 33.22,17.3 33.22,14.71 34.52,13.41 34.52,12.8 33.91,12.19 32.69,12.19 31.09,10.59 30.37,10.59 IC3.41
BUSS+  (via drill 0.4 pad 0.65)
  Top 0.152: R12.P$2 14.01,17.21 13.99,17.22 13.5,17.7 13.12,17.7 | v12.52,17.7 13.12,17.7 | 13.12,17.7 12.63,17.93 v12.52,17.7 | 13.12,17.7 12.63,17.48 v12.52,17.7
  Bottom 0.152: X4.MF1 4.39,18.9 11.3,18.9 12.09,18.12 | 12.09,18.12 v12.52,17.7 | 12.09,18.12 12.29,17.61 v12.52,17.7 | 12.09,18.12 12.61,17.94 v12.52,17.7
  Bottom 0.406: X4.MF1 3.28,16.92 1.32,14.96 X4.2 X4.4
CAN_+5V  (via drill 0.4 pad 0.65)
  Top 0.152: C13.P$2 8.78,4.56 9.53,3.81 9.53,2.97 10.16,2.34 13.05,2.34 | IC6.1 18.85,5.11 17.7,6.25 15.7,6.25 15.44,5.99 15.44,4.24 | 13.05,2.34 13.54,2.34 v13.64,2.44 | v13.64,2.44 14.06,2.86 | 14.06,2.86 15.44,4.24 | 15.44,4.24 IC5.3 | 13.05,2.34 13.57,2.2 v13.64,2.44 | 13.05,2.34 13.5,2.65 v13.64,2.44 | 14.06,2.86 13.55,2.67 v13.64,2.44 | 14.06,2.86 13.88,2.35 v13.64,2.44
  Top 0.406: R33.P$1 5.28,2.82 4.85,3.25 4.85,3.26 X3.4 6.59,3.94 LED5.A C13.P$2
  Bottom 0.406: v13.64,2.44 13.08,2.44 C16.P$1 | v13.64,2.44 13.62,2.32 13.04,2.4 13.61,2.56 v13.64,2.44
CAN_GND  (via drill 0.4 pad 0.65)
  Top 0.406: 7.66,7.62 7.26,7.62 v7.09,7.8 | 7.66,7.62 R34.P$2 | v20.73,1.29 20.13,1.29 | 20.13,1.29 IC6.4 | v14.99,2.31 15.16,2.46 15.42,2.72 | 15.42,2.72 15.67,2.97 IC5.2 | 14.56,1.89 14.25,1.57 12.57,1.57 12.45,1.7 IC5.8 9.64,1.7 | 14.56,1.89 v14.99,2.31 | R11.P$1 8.39,2.01 8.52,2.01 | 8.52,2.01 v9.12,2.01 | C13.P$1 9.12,2.68 9.12,2.61 | v9.12,2.01 9.12,2.61 | 9.64,1.7 9.42,1.7 v9.12,2.01 | X3.1 6.5,7.69 | 6.5,7.69 6.98,7.69 v7.09,7.8 | 8.52,2.01 9.09,1.89 v9.12,2.01 | 8.52,2.01 9.09,2.13 v9.12,2.01 | 9.12,2.61 9,2.03 v9.12,2.01 | 9.12,2.61 9.24,2.03 v9.12,2.01 | 9.64,1.7 9.2,2.1 v9.12,2.01 | 9.64,1.7 9.08,1.89 v9.12,2.01 | 7.66,7.62 7.15,7.91 v7.09,7.8 | 7.66,7.62 7.08,7.67 v7.09,7.8 | 6.5,7.69 7.08,7.67 v7.09,7.8 | 6.5,7.69 7.04,7.91 v7.09,7.8 | 20.13,1.29 20.7,1.17 v20.73,1.29 | 20.13,1.29 20.7,1.42 v20.73,1.29 | 15.42,2.72 14.92,2.42 v14.99,2.31 | 15.42,2.72 15.09,2.24 v14.99,2.31 | 14.56,1.89 15.05,2.21 v14.99,2.31 | 14.56,1.89 14.88,2.38 v14.99,2.31
  Route15 0.406: 20.13,1.29 16.15,1.29 15.44,1.92 | 20.13,1.29 v20.73,1.29 | v14.99,2.31 15.44,1.92 | 20.13,1.29 20.7,1.17 v20.73,1.29 | 20.13,1.29 20.7,1.42 v20.73,1.29 | 15.44,1.92 15.09,2.39 v14.99,2.31 | 15.44,1.92 14.93,2.2 v14.99,2.31
  Bottom 0.406: C16.P$2 10.15,2.01 9.72,2.01 | v9.12,2.01 9.72,2.01 | 9.72,2.01 9.14,2.13 v9.12,2.01 | 9.72,2.01 9.14,1.89 v9.12,2.01
  pour Route2 (isolate 0.254): 13.08,5.33 9.65,1.91 8.51,1.91 6.22,4.19 6.22,7.75 6.73,8.26 7.75,8.26 9.27,6.73 12.57,6.73 13.08,6.22
CAN_H
  Top 0.152: X3.3 8.19,5.19 8.46,5.46 8.46,6.03 R20.P$1 8.89,6.04 9.55,5.38 9.55,4.45 9.91,4.09 9.91,3.63 10.57,2.97 IC5.7
CAN_L
  Top 0.152: X3.2 4.88,6.43 6.12,6.43 6.5,6.04 R20.P$2 6.95,6.24 7.49,6.78 8.89,6.78 9.93,5.74 9.93,4.88 10.57,4.24 IC5.6
CAN_RX
  Top 0.152: R36.P$2 23.28,3.83 IC6.7 26.04,3.83 26.29,3.58 27.18,3.58 27.58,3.99 27.58,5 26.86,5.73 IC3.32
CAN_TX
  Top 0.152: IC3.33 27.36,5.79 27.99,5.16 27.99,3.79 26.77,2.56 IC6.6 23.67,2.56 23.24,2.13 R35.P$2
CURRENT  (via drill 0.4 pad 0.65)
  Top 0.152: v23.32,10.13 23.32,10.73 | 23.32,10.73 23.32,12.98 22.69,13.6 IC3.14 20.61,13.6 20.22,13.99 TP16.P$1 | 23.32,10.73 23.09,10.24 v23.32,10.13 | 23.32,10.73 23.55,10.24 v23.32,10.13
  Bottom 0.152: IC4.1 23.11,9.3 23.32,9.5 23.32,9.53 | 23.32,9.53 v23.32,10.13 | 22.74,10.28 22.89,10.13 v23.32,10.13 | 22.74,10.28 22.48,10.54 R31.P$1 | 23.32,9.53 23.55,10.03 v23.32,10.13 | 23.32,9.53 23.09,10.03 v23.32,10.13 | 22.74,10.28 23.16,9.94 v23.32,10.13 | 22.74,10.28 23.27,10.38 v23.32,10.13
GND  (via drill 0.4 pad 0.65)
  Top 0.152: 25.38,16.09 25.38,15.62 IC3.8 | 25.38,16.09 v25.38,16.69 | R34.P$1 9.44,7.68 | 25.38,16.09 25.6,16.58 v25.38,16.69 | 25.38,16.09 25.15,16.58 v25.38,16.69
  Top 0.305: 25.42,20.34 24.98,20.34 v24.84,20.19 | 25.42,20.34 U2.12 | 25.42,20.34 24.85,20.37 v24.84,20.19 | 25.42,20.34 24.93,20.04 v24.84,20.19
  Bottom 0.152: R28.P$1 25.9,6.44 | C8.P$2 25.83,16.23 25.8,16.26 | v25.38,16.69 25.8,16.26 | 25.8,16.26 25.61,16.77 v25.38,16.69 | 25.8,16.26 25.29,16.45 v25.38,16.69
  Bottom 0.305: C34.P$2 23.71,20.04
  Bottom 0.406: X4.12 X4.14 1.32,8.2 | 1.32,8.2 v1.32,7.6 v1.32,7.59 | v2.29,6.27 2.29,5.67 | 2.29,5.67 2.29,5.33 2.52,5.11 2.54,5.11 2.56,5.08 X4.MF2 | IC2.4 13.43,14.15 | 13.43,14.15 v12.83,14.15 | v12.83,14.15 12.75,14.15 | C9.P$2 C12.P$1 | 19.2,15.04 18.59,15.04 17.64,14.09 | 17.64,14.09 17.63,14.07 v17.63,13.49 | IC11.4 19.81,14.96 21.21,13.56 22.3,13.56 22.33,13.59 | 1.32,8.2 1.2,7.62 v1.32,7.59 | 1.32,8.2 1.44,7.62 v1.32,7.59 | 2.29,5.67 2.41,6.25 v2.29,6.27 | 2.29,5.67 2.17,6.25 v2.29,6.27 | 17.64,14.09 17.51,13.52 v17.63,13.49 | 17.64,14.09 17.75,13.51 v17.63,13.49 | 13.43,14.15 12.85,14.27 v12.83,14.15 | 13.43,14.15 12.85,14.03 v12.83,14.15
  Bottom 0.61: v7.8,21.41 9.53,21.41 9.53,19.71 9.55,19.68 8.15,19.68 | IC11.4 19.2,15.04 19.2,16.31
  other vias: 4.11,1.75 4.11,2.59 4.11,0.91 12.75,3.3 15.77,18.97 16.66,10.29 28.91,5.82 29.11,12.88 6.45,22.12 15.67,7.98 0.89,16.33 36.27,4.06 30.25,20.04 11.91,9.09 32.72,21.21 24.51,10.11 35.74,15.09 22.48,0.91 38.35,18.92 38.35,14.73
  pour Top (isolate 0.203, rank 6): 0,0 0,22.86 39.24,22.86 39.24,0
  pour Bottom (isolate 0.254, rank 6): 0,0 0,22.86 39.24,22.86 39.24,0
  pour Route2 (isolate 0.254, rank 2): 0,0 0,22.86 39.24,22.86 39.24,0
LEDA
  Top 0.152: R1.P$1 9.68,13.72 9.68,14.35 10.29,14.96 11.58,14.96 11.86,14.68 11.86,14.2 13.28,12.78 15.11,12.78 15.19,12.85 15.95,12.85 16.2,12.6 IC3.16
LEDB
  Top 0.152: R3.P$1 9.7,10.79 10.28,11.37 10.71,11.35 12.7,11.35 13.13,10.92 16.84,10.92 17.17,11.25 19,11.25 19.3,10.95 20.3,10.95 20.95,11.6 IC3.18
LEDG
  Top 0.152: 9.63,12.19 R2.P$1 10.16,12.19 10.54,11.81 12.83,11.81 13.34,11.3 16.38,11.3 16.71,11.63 19.15,11.63 19.41,11.38 20.09,11.38 20.82,12.1 IC3.17
LEDR
  Top 0.152: IC3.19 21.01,11.1 20.42,10.52 19.18,10.52 18.87,10.82 18.14,10.82 16.92,9.6 15.49,9.6 15.19,9.3 14.45,9.3 13.79,9.96 11.02,9.96 10.21,9.14 R4.P$1
N$1
  Top 0.152: LED5.C 7.11,3.05 6.72,2.65 R11.P$2
N$2  (via drill 0.4 pad 0.65)
  Top 0.406: 10.63,18.73 10.44,18.54 v10.44,18.16 | 10.63,18.73 D1.1 | 10.63,18.73 10.33,18.22 v10.44,18.16 | 10.63,18.73 10.56,18.15 v10.44,18.16
  Bottom 0.152: IC2.8 6.79,17.96 C23.+
  Bottom 0.406: IC2.8 9.12,18.01 9.86,18.01 | 9.86,18.01 10.29,18.01 v10.44,18.16 | 9.86,18.01 10.45,18.04 v10.44,18.16 | 9.86,18.01 10.38,18.27 v10.44,18.16
N$3
  Top 0.152: LED1.C R1.P$2
N$4
  Top 0.152: LED4.C R4.P$2
N$5
  Top 0.152: LED3.C R3.P$2
N$6
  Top 0.152: X2.2 5.81,17.64 5.84,17.63 6.25,17.63 6.95,16.93 R21.P$2
N$7  (via drill 0.4 pad 0.65)
  Top 0.152: v10.79,12.6 10.86,12.58 11.39,12.58 | 11.39,12.58 C24.+ | D3.1 10.79,13.84 10.79,13.2 | v10.79,12.6 10.79,13.2 | 11.39,12.58 10.91,12.82 v10.79,12.6 | 11.39,12.58 10.89,12.37 v10.79,12.6 | 10.79,13.2 10.57,12.7 v10.79,12.6 | 10.79,13.2 11.02,12.7 v10.79,12.6
  Bottom 0.152: IC9.8 9.09,12.6 10.2,12.6 | 10.2,12.6 v10.79,12.6 | 10.2,12.6 10.69,12.37 v10.79,12.6 | 10.2,12.6 10.69,12.83 v10.79,12.6
N$8  (via drill 0.4 pad 0.65)
  Top 0.406: v10.46,7.47 10.89,7.89 | 10.89,7.89 D4.1 | 10.89,7.89 10.4,7.57 v10.46,7.47 | 10.89,7.89 10.57,7.4 v10.46,7.47
  Bottom 0.152: C25.+ 7.8,6.88 8.16,7.25 IC10.8
  Bottom 0.406: IC10.8 9.9,7.26 | 9.9,7.26 10.26,7.26 v10.46,7.47 | 9.9,7.26 10.48,7.34 v10.46,7.47 | 9.9,7.26 10.4,7.57 v10.46,7.47
N$10
  Top 0.152: LED2.C R2.P$2
N$11
  Bottom 0.152: R27.P$1 18.59,1.75 18.97,2.13 23.01,2.13 23.7,2.82 23.7,4.88 24.38,5.56 24.38,6.29 R28.P$2 24.4,6.95 24.46,7.01 R29.P$2 23.88,7.71 23.57,7.41 IC4.3
N$12
  Bottom 0.152: R30.P$2 21.74,12.06 20.97,11.29 R31.P$2 21.13,10.53 21.13,8.89 20.19,7.95 IC4.4
N$13
  Top 0.152: IC5.1 17.86,1.7 18.67,2.52 19.27,2.52 IC6.3 20.68,2.56 21.26,1.98 R35.P$1
N$14
  Top 0.152: IC5.4 17.35,5.51 18.03,4.83 18.03,4.52 18.67,3.89 19.27,3.89 IC6.2 21.68,3.83 R36.P$1
N$20
  Top 0.152: X2.3 6,16.39 6.63,15.75 6.95,15.43 R24.P$2
N$22
  Bottom 0.406: C3.P$1 30.31,11.26 IC1.4
N$33
  Top 0.152: IC3.26 23.86,7.84 23.55,8.15 22.71,8.15 22.26,7.71 R8.P$1
N$36  (via drill 0.4 pad 0.65)
  Top 0.152: IC3.27 24.36,6.33 24.16,6.12 23.34,6.12 22.33,5.11 22.32,5.11 | v21.72,5.11 22.32,5.11 | 22.32,5.11 21.82,5.33 v21.72,5.11 | 22.32,5.11 21.82,4.88 v21.72,5.11
  Bottom 0.152: R9.P$1 21.13,4.98 | 21.13,4.98 21.59,4.98 v21.72,5.11 | 21.13,4.98 21.66,4.86 v21.72,5.11 | 21.13,4.98 21.57,5.31 v21.72,5.11
N$39  (via drill 0.4 pad 0.65)
  Top 0.152: v22.48,3.05 22.48,3.65 | 22.48,3.65 22.48,4.65 23.55,5.71 24.46,5.71 24.86,6.12 IC3.28 | 22.48,3.65 22.25,3.15 v22.48,3.05 | 22.48,3.65 22.71,3.15 v22.48,3.05
  Bottom 0.152: R10.P$1 21.88,3.07 | 21.88,3.07 22.45,3.07 v22.48,3.05 | 21.88,3.07 22.36,2.83 v22.48,3.05 | 21.88,3.07 22.38,3.28 v22.48,3.05
N$40
  Top 0.152: Q1.3 28.45,16.46 27.05,16.46 26.86,16.27 IC3.5
N$41  (via drill 0.4 pad 0.65)
  Top 0.152: 19.14,12.04 16.38,12.04 16,11.66 15.01,11.66 14.66,12.01 R5.P$2 | 19.14,12.04 v19.74,12.04 | IC3.29 25.36,10.28 24.61,11.03 | v24.33,11.56 24.33,11.3 24.61,11.03 | 19.14,12.04 19.63,11.81 v19.74,12.04 | 19.14,12.04 19.63,12.27 v19.74,12.04 | 24.61,11.03 24.58,11.57 v24.33,11.56 | 24.61,11.03 24.18,11.36 v24.33,11.56
  Bottom 0.152: v19.74,12.04 20.34,12.04 | 20.34,12.04 20.4,12.04 21.18,12.83 23.06,12.83 23.91,11.98 | 23.91,11.98 v24.33,11.56 | 20.34,12.04 19.84,12.27 v19.74,12.04 | 20.34,12.04 19.84,11.81 v19.74,12.04 | 23.91,11.98 24.1,11.47 v24.33,11.56 | 23.91,11.98 24.42,11.79 v24.33,11.56
N$42  (via drill 0.4 pad 0.65)
  Top 0.152: 25.86,10.34 25.86,10.66 v25.63,10.9 | 25.86,10.34 IC3.30 | 25.86,10.34 25.88,10.89 v25.63,10.9 | 25.86,10.34 25.46,10.71 v25.63,10.9
  Bottom 0.152: R6.P$2 18.81,7.17 19.36,6.63 20.95,6.63 21.87,7.54 21.87,9.53 21.72,9.68 21.72,11.2 21.97,11.46 22.91,11.46 23.47,10.9 25.03,10.9 | 25.03,10.9 v25.63,10.9 | 25.03,10.9 25.52,10.67 v25.63,10.9 | 25.03,10.9 25.52,11.12 v25.63,10.9
N$45  (via drill 0.4 pad 0.65)
  Top 0.152: IC3.31 26.34,7.08 26.34,5.78 | v26.39,5.18 26.39,5.33 26.34,5.38 26.34,5.78 | 26.34,5.78 26.16,5.27 v26.39,5.18 | 26.34,5.78 26.61,5.3 v26.39,5.18
  Bottom 0.152: R7.P$2 24.45,4.43 24.46,4.45 25.18,5.18 25.79,5.18 | 25.79,5.18 v26.39,5.18 | 25.79,5.18 26.29,4.95 v26.39,5.18 | 25.79,5.18 26.29,5.41 v26.39,5.18
PB8
  Top 0.152: IC3.45 31.52,12.6 TP20.P$1
PB9
  Top 0.152: IC3.46 31.47,13.1 31.55,13.18 TP21.P$1
PB10
  Top 0.152: IC3.21 18.56,10.1 TP22.P$1
PB11
  Top 0.152: IC3.22 20.65,9.6 TP23.P$1
PHASE_U  (via drill 0.4 pad 0.65)
  Top 0.152: R14.P$1 27.16,21.86 26.82,22.2 7.64,22.2 5.71,20.27 3.96,20.27 2.46,18.77 2.46,15.42 3.08,14.8 | v3.5,14.38 3.08,14.8 | 3.08,14.8 3.27,14.29 v3.5,14.38 | 3.08,14.8 3.59,14.61 v3.5,14.38
  Bottom 0.152: IC2.6 7.7,15.42 7.02,16.09 C23.- 6.76,14.25 6.44,13.93 X4.3 3.95,13.93 3.93,13.95 | v3.5,14.38 3.93,13.95 | 3.93,13.95 3.74,14.46 v3.5,14.38 | 3.93,13.95 3.42,14.14 v3.5,14.38
PHASE_V  (via drill 0.4 pad 0.65)
  Top 0.152: v11.53,17.22 12.01,17.22 12.12,17.11 | 12.12,17.11 12.22,17.02 12.62,17.02 13.26,16.38 13.26,15.39 13.56,15.09 14.63,15.09 14.94,15.39 16.38,15.39 16.98,14.79 R16.P$1 | 11.52,10.68 10.96,10.68 v10.92,10.67 | 11.52,10.68 C24.- | 11.52,10.68 11.02,10.9 v10.92,10.67 | 11.52,10.68 11.03,10.44 v10.92,10.67 | 12.12,17.11 11.68,17.43 v11.53,17.22 | 12.12,17.11 11.59,16.98 v11.53,17.22
  Bottom 0.152: X4.9 6.98,10.93 7.87,10.03 IC9.6 10.29,10.03 10.5,10.24 | 11.53,16.62 11.53,11.28 11.35,11.09 | 11.53,16.62 v11.53,17.22 | v10.92,10.67 11.35,11.09 | 10.5,10.24 v10.92,10.67 | 11.35,11.09 10.84,10.9 v10.92,10.67 | 11.35,11.09 11.16,10.58 v10.92,10.67 | 10.5,10.24 11.01,10.43 v10.92,10.67 | 10.5,10.24 10.69,10.76 v10.92,10.67 | 11.53,16.62 11.76,17.12 v11.53,17.22 | 11.53,16.62 11.3,17.12 v11.53,17.22
PHASE_W  (via drill 0.4 pad 0.65)
  Top 0.152: v3.35,15.62 3.66,15.93 3.66,16.14 | 3.66,16.14 3.66,19.36 4.04,19.74 6.02,19.74 6.17,19.89 R18.P$1 | 3.66,16.14 3.21,15.83 v3.35,15.62 | 3.66,16.14 3.6,15.6 v3.35,15.62
  Bottom 0.152: 2.62,11.43 X4.8 | 2.62,11.43 3.58,10.46 3.58,7.67 5.46,5.79 5.46,4.34 6.04,3.76 7.01,3.76 8.03,2.74 10.26,2.74 10.46,2.95 10.46,4.47 10.21,4.72 IC10.6 7.33,4.72 C25.- | 2.62,11.43 2.82,11.63 2.82,15.09 2.93,15.2 | 2.93,15.2 v3.35,15.62 | 2.93,15.2 3.44,15.39 v3.35,15.62 | 2.93,15.2 3.12,15.71 v3.35,15.62
RST  (via drill 0.4 pad 0.65)
  Top 0.152: IC3.7 25.86,14.6 26.44,14.02 26.53,14.02 | v27.13,14.02 26.53,14.02 | JTAG.10 33.45,10.34 33.45,10.53 | v33.45,11.12 33.45,10.53 | 26.53,14.02 27.02,13.79 v27.13,14.02 | 26.53,14.02 27.02,14.25 v27.13,14.02 | 33.45,10.53 33.68,11.02 v33.45,11.12 | 33.45,10.53 33.22,11.02 v33.45,11.12
  Bottom 0.152: 27.73,14.03 27.14,14.03 v27.13,14.02 | 27.73,14.03 C6.P$2 28.74,14.03 28.94,13.83 30.73,13.82 33.03,11.55 | 33.03,11.55 v33.45,11.12 | 27.73,14.03 27.23,14.25 v27.13,14.02 | 27.73,14.03 27.24,13.79 v27.13,14.02 | 33.03,11.55 33.22,11.04 v33.45,11.12 | 33.03,11.55 33.54,11.36 v33.45,11.12
RXD
  Top 0.152: R21.P$1 R19.P$2 8.91,18.36 10.59,20.04 11.71,20.04 13.26,18.49 14.71,18.49 15.7,17.5 18.92,17.5 19.28,17.14 22.17,17.14 22.78,16.54 22.78,14.94 24.69,13.03 27.74,13.03 29.16,11.6 IC3.43
SHUNT
  Bottom 0.152: X4.10 2.47,10.43 2.87,10.03 2.87,8.05 1.09,6.27 1.09,4.24 1.32,4.01 5.18,4.01 5.87,3.33 6.71,3.33 9.25,0.79 14.88,0.79 15.85,1.75 R27.P$2
STAR_VOLTAGE  (via drill 0.4 pad 0.65)
  Top 0.152: 21.81,18.47 20.9,18.47 20.82,18.39 U2.6 19.46,18.39 19.07,18.77 19.07,19.05 18.48,19.65 R26.P$2 18.22,19.65 TP9.P$1 | 21.81,18.47 21.89,18.47 v22.28,18.09 | 24.83,18.68 24.79,18.64 v24.79,18.09 | 24.83,18.68 25.18,19.04 U2.10 26.47,19.04 R23.P$2 | 25.28,17.73 25.14,17.73 v24.79,18.09 | 25.28,17.73 U2.8 | 24.83,18.68 24.57,18.2 v24.79,18.09 | 24.83,18.68 25.02,18.17 v24.79,18.09 | 25.28,17.73 25.01,18.21 v24.79,18.09 | 25.28,17.73 24.74,17.84 v24.79,18.09 | 21.81,18.47 22.05,17.98 v22.28,18.09 | 21.81,18.47 22.34,18.33 v22.28,18.09
  Bottom 0.152: R25.P$2 25.49,19.34 24.83,18.68 | 24.83,18.68 24.79,18.64 v24.79,18.09 | v22.28,18.09 22.88,18.09 | 22.88,18.09 24.19,18.09 | 24.19,18.09 v24.79,18.09 | 24.83,18.68 24.57,18.2 v24.79,18.09 | 24.83,18.68 25.02,18.17 v24.79,18.09 | 24.19,18.09 24.68,17.86 v24.79,18.09 | 24.19,18.09 24.68,18.31 v24.79,18.09 | 22.88,18.09 22.38,18.31 v22.28,18.09 | 22.88,18.09 22.38,17.86 v22.28,18.09
TCK
  Top 0.152: JTAG.4 31.32,6.45 30.68,7.09 30.68,7.85 30.36,8.17 IC3.37
TDI  (via drill 0.4 pad 0.65)
  Top 0.152: v35.05,11.28 35.26,11.07 35.26,10.71 | 35.26,10.71 35.26,9.22 35.03,8.99 JTAG.8 | IC3.38 31.03,9.1 31.24,8.89 31.24,7.96 | 31.24,7.96 31.24,7.47 v31.34,7.37 | 31.24,7.96 31.1,7.43 v31.34,7.37 | 31.24,7.96 31.55,7.51 v31.34,7.37 | 35.26,10.71 35.3,11.26 v35.05,11.28 | 35.26,10.71 34.87,11.1 v35.05,11.28
  Bottom 0.152: 35.05,10.68 35.05,10.31 32.11,7.37 31.94,7.37 | 35.05,10.68 v35.05,11.28 | v31.34,7.37 31.94,7.37 | 31.94,7.37 31.45,7.59 v31.34,7.37 | 31.94,7.37 31.45,7.14 v31.34,7.37 | 35.05,10.68 35.28,11.17 v35.05,11.28 | 35.05,10.68 34.82,11.17 v35.05,11.28
TDO
  Top 0.152: IC3.39 31.16,9.6 31.62,9.14 31.62,8.36 32.26,7.72 JTAG.6
TEMP  (via drill 0.4 pad 0.65)
  Top 0.152: TP17.P$1 18.75,13.41 | 19.11,13.23 18.85,13.23 TP17.P$1 | 19.11,13.23 v19.71,13.23 | IC3.15 21.11,13.1 20.75,13.11 20.3,13.11 | 20.3,13.11 19.84,13.11 v19.71,13.23 | TP17.P$1 R32.P$2 | 19.11,13.23 19.61,13.01 v19.71,13.23 | 19.11,13.23 19.61,13.46 v19.71,13.23 | 20.3,13.11 19.86,13.43 v19.71,13.23 | 20.3,13.11 19.77,12.99 v19.71,13.23
  Bottom 0.152: 19.14,13.06 19.29,13.22 v19.71,13.23 | 19.14,13.06 18.85,12.78 TH1.P$1 | 19.14,13.06 19.67,12.98 v19.71,13.23 | 19.14,13.06 19.55,13.42 v19.71,13.23
TMS
  Top 0.152: IC3.34 27.86,5.84 28.45,5.26 28.45,4.88 29.36,3.96 30.61,3.96 31.83,5.18 JTAG.2
TXD
  Top 0.152: R24.P$1 8.46,15.49 9.02,16.05 9.02,16.89 9.58,17.45 10.69,17.45 11.61,18.36 12.8,18.36 13.08,18.09 14.55,18.09 15.65,16.99 18.77,16.99 18.95,16.82 21.92,16.82 22.38,16.36 22.38,14.88 24.69,12.57 27.61,12.57 29.08,11.1 IC3.42
U_COMM
  Top 0.152: IC3.10 24.36,16.79 24.08,17.07 24.08,20.34 24.72,20.98 U2.13 29.7,20.98 TP6.P$1
U_GATE_HIGH
  Bottom 0.152: X4.1 5.24,16.16 6.04,16.97 7.64,16.97 7.92,16.69 IC2.7
U_GATE_LOW
  Bottom 0.152: X4.5 6.4,12.93 7.62,14.15 IC2.5
U_HIGH  (via drill 0.4 pad 0.65)
  Top 0.152: 15.53,13.64 TP10.P$1 15.03,13.53 R5.P$1 | 15.53,13.64 v16.13,13.64 | 15.53,13.64 16.02,13.41 v16.13,13.64 | 15.53,13.64 16.02,13.87 v16.13,13.64
  Bottom 0.152: IC2.2 15.24,16.69 16.13,15.8 16.13,14.24 | v16.13,13.64 16.13,14.24 | 16.13,14.24 15.9,13.74 v16.13,13.64 | 16.13,14.24 16.36,13.74 v16.13,13.64
U_LOW  (via drill 0.4 pad 0.65)
  Top 0.152: 18.33,8.84 18.59,8.84 19.05,8.38 TP11.P$1 20.56,6.4 R8.P$2 | 18.33,8.84 18.16,8.84 v17.83,9.17 | 18.33,8.84 18.04,9.3 v17.83,9.17 | 18.33,8.84 17.79,8.92 v17.83,9.17
  Bottom 0.152: IC2.3 15.21,15.42 15.47,15.16 15.47,13.36 15.8,13.03 17.14,13.03 17.48,12.7 17.48,10.36 17.83,10.01 17.83,9.77 | v17.83,9.17 17.83,9.77 | 17.83,9.77 17.6,9.27 v17.83,9.17 | 17.83,9.77 18.06,9.27 v17.83,9.17
U_VOLTAGE
  Top 0.152: TP3.P$1 32.75,20.36 C36.P$1 31.33,20.65 29.87,20.65 29.59,20.37 28.91,20.37 R15.P$1 R14.P$2 27.36,19.91 27.43,19.84 27.43,19.57 R23.P$1 26.85,19.42 26.58,19.68 U2.11
USART_+5V
  Top 0.406: X2.4 4.5,15.14 D2.A
V_BATT
  Top 0.152: R12.P$1 14.35,15.72 14.92,16.3 R13.P$2 15.93,16.3 16.26,16.28 16.46,16.08 16.46,15.85 16.76,15.54 17.78,15.54 18.16,15.16 19.33,15.16 19.61,15.44 20.65,15.44 21.03,15.06 21.03,14.55 21.48,14.1 IC3.13
V_COMM  (via drill 0.4 pad 0.65)
  Top 0.152: v33.68,21.79 34.28,21.79 | 34.28,21.79 TP7.P$1 | 24.41,21.22 23.55,20.35 23.55,17.07 23.86,16.75 IC3.11 | 24.41,21.22 v24.83,21.64 | U2.14 25.43,21.64 | v24.83,21.64 25.43,21.64 | 24.41,21.22 24.92,21.41 v24.83,21.64 | 24.41,21.22 24.6,21.73 v24.83,21.64 | 25.43,21.64 24.94,21.87 v24.83,21.64 | 25.43,21.64 24.94,21.41 v24.83,21.64 | 34.28,21.79 33.78,22.02 v33.68,21.79 | 34.28,21.79 33.78,21.57 v33.68,21.79
  Bottom 0.152: v24.83,21.64 25.43,21.64 | 25.43,21.64 26.59,21.64 27.13,22.17 33.22,22.17 | 33.22,22.17 33.3,22.17 v33.68,21.79 | 25.43,21.64 24.94,21.87 v24.83,21.64 | 25.43,21.64 24.94,21.41 v24.83,21.64 | 33.22,22.17 33.45,21.68 v33.68,21.79 | 33.22,22.17 33.74,22.04 v33.68,21.79
V_GATE_HIGH
  Bottom 0.152: X4.7 7.09,11.93 7.72,11.3 IC9.7
V_GATE_LOW
  Bottom 0.152: X4.11 6.88,9.93 8.05,8.76 IC9.5
V_HIGH  (via drill 0.4 pad 0.65)
  Top 0.152: TP12.P$1 14.83,10.24 15.05,10.24 | 15.05,10.24 v15.65,10.24 | 15.05,10.24 15.54,10.01 v15.65,10.24 | 15.05,10.24 15.54,10.46 v15.65,10.24
  Bottom 0.152: 17.3,7.89 R6.P$1 17.31,8.57 16.07,9.81 | IC9.2 14.76,11.3 15.32,10.74 | 15.32,10.74 15.65,10.41 v15.65,10.24 | v15.65,10.24 16.07,9.81 | 15.32,10.74 15.4,10.2 v15.65,10.24 | 15.32,10.74 15.78,10.45 v15.65,10.24 | 16.07,9.81 15.88,10.32 v15.65,10.24 | 16.07,9.81 15.56,10 v15.65,10.24
V_LOW  (via drill 0.4 pad 0.65)
  Top 0.152: v15.88,8.91 15.98,8.81 16.47,8.81 | 16.47,8.81 TP13.P$1 | 16.47,8.81 16.02,9.12 v15.88,8.91 | 16.47,8.81 15.94,8.67 v15.88,8.91
  Bottom 0.152: R9.P$2 18.44,4.98 16.48,6.93 16.48,8.31 16.3,8.49 | v15.88,8.91 16.3,8.49 | IC9.3 14.76,10.03 15.45,9.34 | 15.45,9.34 v15.88,8.91 | 16.3,8.49 16.11,9 v15.88,8.91 | 16.3,8.49 15.79,8.68 v15.88,8.91 | 15.45,9.34 15.64,8.83 v15.88,8.91 | 15.45,9.34 15.96,9.15 v15.88,8.91
V_VOLTAGE  (via drill 0.4 pad 0.65)
  Top 0.152: U2.9 26.34,18.39 26.67,18.06 26.67,17.22 TP4.P$1 26.52,17.07 26.78,17.07 | v27.38,17.07 26.78,17.07 | R16.P$2 17.8,16.29 18,16.48 18.17,16.48 21.28,16.48 | 21.28,16.48 21.31,16.48 v21.72,16.08 | 26.78,17.07 27.28,16.84 v27.38,17.07 | 26.78,17.07 27.28,17.3 v27.38,17.07 | 21.28,16.48 21.48,15.98 v21.72,16.08 | 21.28,16.48 21.79,16.32 v21.72,16.08
  Bottom 0.152: C37.P$1 R17.P$1 28.35,17.22 28.19,17.07 27.98,17.07 | v21.72,16.08 22.32,16.08 | 22.32,16.08 23.85,16.08 25.61,17.84 R25.P$1 26.33,17.84 26.72,17.45 26.92,17.45 | 26.92,17.45 27,17.45 v27.38,17.07 | v27.38,17.07 27.98,17.07 | 26.92,17.45 27.16,16.96 v27.38,17.07 | 26.92,17.45 27.45,17.31 v27.38,17.07 | 27.98,17.07 27.49,17.3 v27.38,17.07 | 27.98,17.07 27.49,16.84 v27.38,17.07 | 22.32,16.08 21.82,16.31 v21.72,16.08 | 22.32,16.08 21.82,15.85 v21.72,16.08
W_COMM
  Top 0.152: TP8.P$1 19.12,21.64 U2.1 20.81,21.66 23.01,19.46 23.01,17.07 23.36,16.72 IC3.12
W_GATE_HIGH
  Bottom 0.152: X4.13 7.05,8.93 7.92,8.05 10.74,8.05 11.12,7.67 11.12,6.83 10.26,5.97 IC10.7
W_GATE_LOW
  Bottom 0.152: X4.15 5.24,7.24 5.89,6.58 5.89,4.57 6.22,4.24 7.26,4.24 8.05,3.45 IC10.5
W_HIGH  (via drill 0.4 pad 0.65)
  Top 0.152: TP14.P$1 12.32,6.6 12.5,6.42 | 12.5,6.42 v12.93,5.99 | 12.5,6.42 12.69,5.91 v12.93,5.99 | 12.5,6.42 13.02,6.23 v12.93,5.99
  Bottom 0.152: R7.P$1 22.38,4.27 22.07,3.96 17.35,3.96 15.32,5.99 IC10.2 13.53,5.99 | v12.93,5.99 13.53,5.99 | 13.53,5.99 13.03,6.22 v12.93,5.99 | 13.53,5.99 13.03,5.77 v12.93,5.99
W_LOW  (via drill 0.4 pad 0.65)
  Top 0.152: v12.88,4.72 13.48,4.72 | 13.48,4.72 13.56,4.72 15.85,7.01 TP15.P$1 | 13.48,4.72 12.98,4.95 v12.88,4.72 | 13.48,4.72 12.98,4.5 v12.88,4.72
  Bottom 0.152: 13.48,4.72 IC10.3 15.44,4.72 17.09,3.07 R10.P$2 | 13.48,4.72 v12.88,4.72 | 13.48,4.72 12.98,4.95 v12.88,4.72 | 13.48,4.72 12.98,4.5 v12.88,4.72
W_VOLTAGE  (via drill 0.4 pad 0.65)
  Top 0.152: R18.P$2 9.45,19.89 9.98,20.42 12.45,20.42 TP5.P$1 13.74,19.13 14.63,19.13 15.61,18.15 C38.P$1 R26.P$1 18.96,18.15 19.37,17.73 U2.7 20.66,17.73 | 20.66,17.73 21.21,17.73 v21.26,17.78 | 20.66,17.73 21.17,17.55 v21.26,17.78 | 20.66,17.73 21.14,18 v21.26,17.78
  Bottom 0.152: R22.P$1 23.63,17.4 21.72,17.4 | 21.72,17.4 21.64,17.4 v21.26,17.78 | 21.72,17.4 21.48,17.89 v21.26,17.78 | 21.72,17.4 21.2,17.54 v21.26,17.78

### Text on the board
Top: CLOGIC V0.2 | OPEN-BLDC | (C) 2010 J.R. | CC-BY-SA
tPlace: UART | G | 5 | B | R | A | T | 5 | G | CAN | ENC | G | L | H | 5 | JTAG
tStop: CLOGIC V0.2 | OPEN-BLDC | (C) 2010 J.R. | CC-BY-SA